# Altium project Holberton.PrjPcb (part 2 of 4)

## Sheet Trinamic.SchDoc
size 420 x 297 mm; SheetNumber: 7; SheetTotal: 14; PageSetup: Record=PageOptions|CenterHorizontal=True|CenterVertical=True|PrintScale=0.96|XCorrection=1.00|YCorrection=1.00|PrintKind=1|BorderSize=5000000|LeftOffset=0|BottomOffset=0|Orientation=2|PaperLength=4318|PaperWidth=2794|Scale=100|PaperSource=7|PrintQuality=600|MediaType=1|DitherType=10|PaperKind=11" x 17"|PrintScaleMode=1
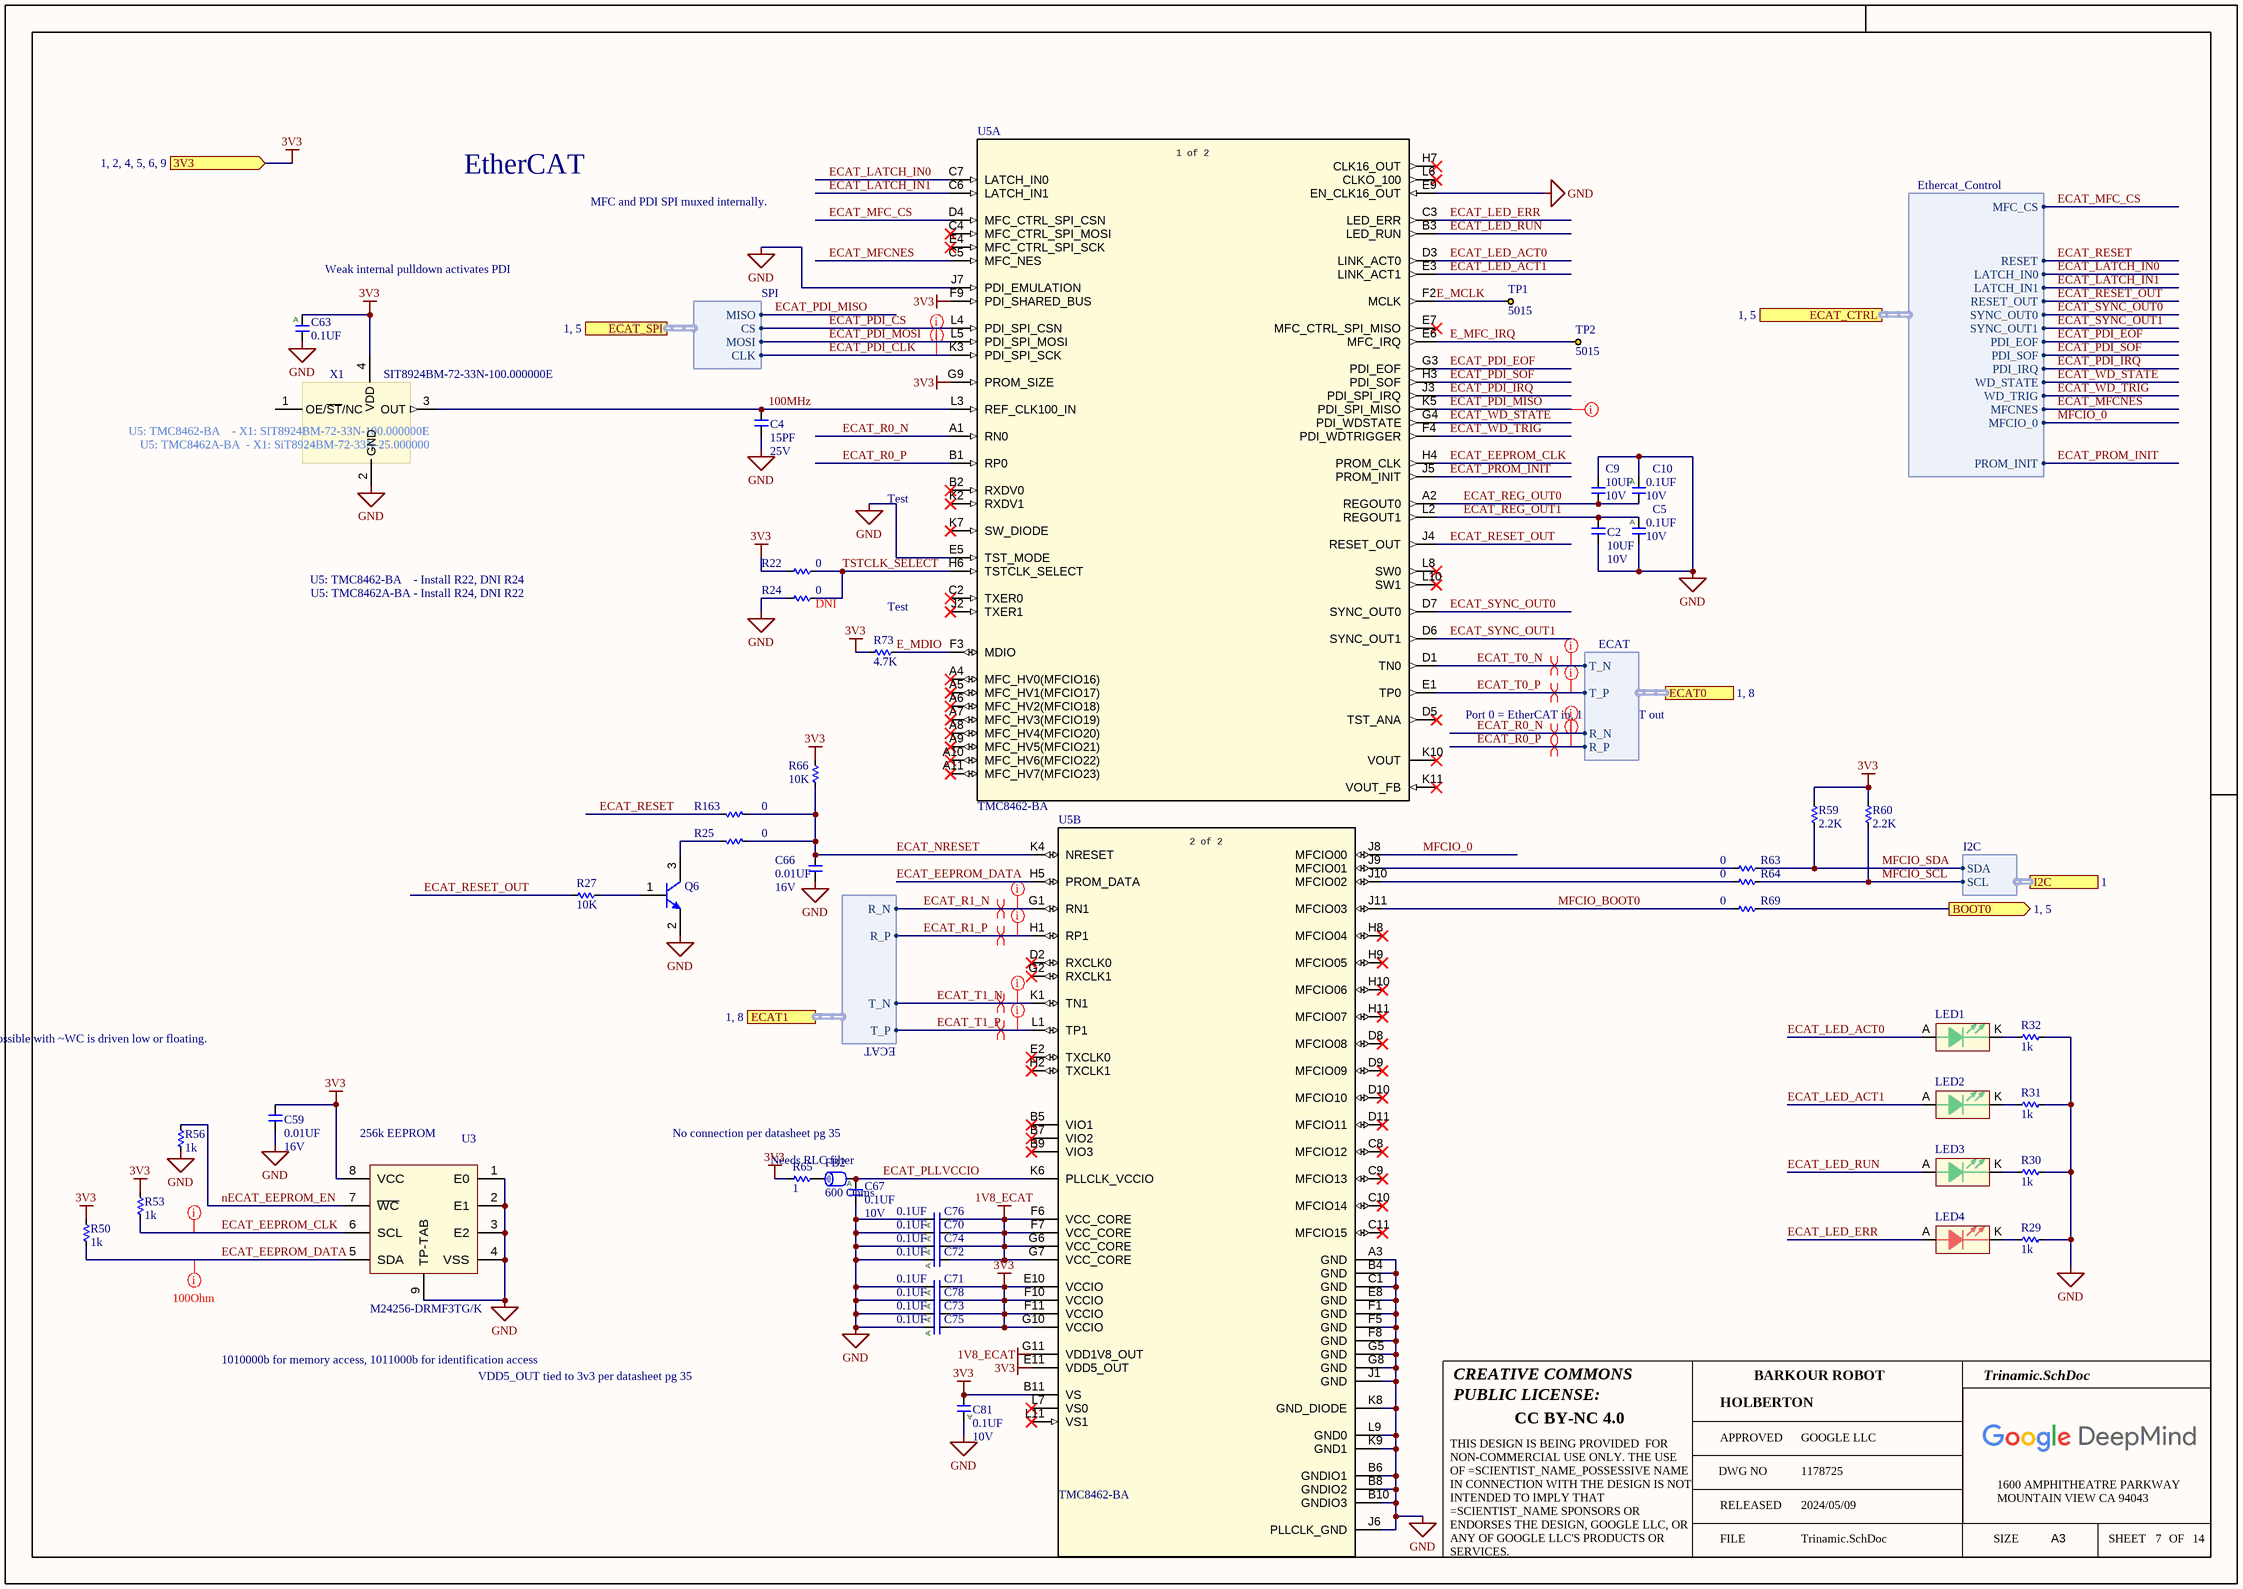
[diagram p4: Trinamic.SchDoc]

### Parts
C2  value 10UF  Voltage: 10V  [C0402]  (hidden comment: __Template_Cap)
C4  value 15PF  Voltage: 25V  [C0201]  (hidden comment: __Template_Cap)
C5  value 0.1UF  Voltage: 10V  [C0201]  (hidden comment: __Template_Cap_Auto)
C9  value 10UF  Voltage: 10V  [C0402]  (hidden comment: __Template_Cap)
C10  value 0.1UF  Voltage: 10V  [C0201]  (hidden comment: __Template_Cap_Auto)
C59  value 0.01UF  Voltage: 16V  [C0201]  (hidden comment: __Template_Cap)
C63  value 0.1UF  [C0201]  (hidden comment: __Template_Cap_Auto)
C66  value 0.01UF  Voltage: 16V  [C0201]  (hidden comment: __Template_Cap)
C67  value 0.1UF  Voltage: 10V  [C0201]  (hidden comment: __Template_Cap_Auto)
C70  value 0.1UF  [C0201]  (hidden comment: __Template_Cap_Auto)
C71  value 0.1UF  [C0201]  (hidden comment: __Template_Cap_Auto)
C72  value 0.1UF  [C0201]  (hidden comment: __Template_Cap_Auto)
C73  value 0.1UF  [C0201]  (hidden comment: __Template_Cap_Auto)
C74  value 0.1UF  [C0201]  (hidden comment: __Template_Cap_Auto)
C75  value 0.1UF  [C0201]  (hidden comment: __Template_Cap_Auto)
C76  value 0.1UF  [C0201]  (hidden comment: __Template_Cap_Auto)
C78  value 0.1UF  [C0201]  (hidden comment: __Template_Cap_Auto)
C81  value 0.1UF  Voltage: 10V  [C0201]  (hidden comment: __Template_Cap_Auto)
FB2  value 600 Ohms  [L0201_H0.33MM]  (hidden comment: __Template_Ferrite_Bead)
LED1  __Template_LED_GREEN_AK  [LED_APHHS1005LCGCK]  (value not drawn)
LED2  __Template_LED_GREEN_AK  [LED_APHHS1005LCGCK]  (value not drawn)
LED3  __Template_LED_GREEN_AK  [LED_APHHS1005LCGCK]  (value not drawn)
LED4  __Template_LED_RED_AK  [LED_APHHS1005LCGCK]  (value not drawn)
Q6  Bipolar NPN 3 Pins Transistor Gummel-Poon Model  [SOT23-3]  (value not drawn)
R22  0  [R0402]
R24  0  [R0402]
R25  0  [R0402]
R27  value 10K  [R0201]  (hidden comment: __Template_Resistor)
R29  value 1k  [R0201]  (hidden comment: __Template_Resistor)
R30  value 1k  [R0201]  (hidden comment: __Template_Resistor)
R31  value 1k  [R0201]  (hidden comment: __Template_Resistor)
R32  value 1k  [R0201]  (hidden comment: __Template_Resistor)
R50  value 1k  [R0201]  (hidden comment: __Template_Resistor)
R53  value 1k  [R0201]  (hidden comment: __Template_Resistor)
R56  value 1k  [R0201]  (hidden comment: __Template_Resistor)
R59  2.2K  [R0201]
R60  2.2K  [R0201]
R63  0  [R0402]
R64  0  [R0402]
R65  1  [R0201]
R66  value 10K  [R0201]  (hidden comment: __Template_Resistor)
R69  0  [R0402]
R73  value 4.7K  [R0201]  (hidden comment: __Template_Resistor)
R163  0  [R0402]
TP1  MFG P/N: 5015  [TP_KEYSTONE_5015]  (hidden comment: TP_KEYSTONE_5015)
TP2  MFG P/N: 5015  [TP_KEYSTONE_5015]  (hidden comment: TP_KEYSTONE_5015)
U3  MFG P/N: M24256-DRMF3TG/K  [8WFDFN300X200X80-8-TP]  (hidden comment: EEPROM_M24256-DRMF3TG/K)
U5  MFG P/N: TMC8462-BA  [BGA121C75P11X11_900X900X145]  (hidden comment: PROCESSOR_TRINAMIC_TMC8462-BA)  (parts A,B of 2)
X1  Mfg P/N: SIT8924BM-72-33N-100.000000E  [XTAL_SIT8924BM-72-33N-100.000000]  (hidden comment: XTAL_SIT8924BM-72-33N-100.000000)

### Ports
3V3 (in, see 1, 2, 4, 5, 6, 9), BOOT0 (out, see 1, 5), ECAT0 (harness ECAT, see 1, 8), ECAT1 (harness ECAT, see 1, 8), ECAT_CTRL (harness Ethercat_Control, see 1, 5), ECAT_SPI (harness SPI, see 1, 5), I2C (harness I2C, see 1)

### Harnesses
Ethercat_Control: MFC_CS, LATCH_IN0, LATCH_IN1, RESET_OUT, SYNC_OUT0, SYNC_OUT1, PDI_EOF, PDI_SOF, PDI_IRQ, RESET, WD_STATE, WD_TRIG, MFCNES, MFCIO_0, PROM_INIT
SPI: MISO, MOSI, CS, CLK
ECAT: R_P, R_N, T_P, T_N
I2C: SDA, SCL

### Nets
1V8_ECAT: C70.2 C72.2 C74.2 C76.2 U5.F6(VCC_CORE) U5.F7(VCC_CORE) U5.G6(VCC_CORE) U5.G7(VCC_CORE) U5.G11(VDD1V8_OUT)
3V3: C59.1 C63.1 C71.2 C73.2 C75.2 C78.2 C81.2 R22.1 R50.2 R53.2 R59.2 R60.2 R65.1 R66.2 R73.2 U3.8(VCC) U5.B11(VS) U5.E10(VCCIO) U5.E11(VDD5_OUT) U5.F9(PDI_SHARED_BUS) U5.F10(VCCIO) U5.F11(VCCIO) U5.G9(PROM_SIZE) U5.G10(VCCIO) X1.4(VDD) ; port 3V3
GND: C2.2 C4.2 C5.2 C9.1 C10.1 C59.2 C63.2 C66.2 C67.2 C70.1 C71.1 C72.1 C73.1 C74.1 C75.1 C76.1 C78.1 C81.1 Q6.2(E) R24.1 R29.1 R30.1 R31.1 R32.1 R56.1 U3.1(E0) U3.2(E1) U3.3(E2) U3.4(VSS) U3.9(TP-TAB) U5.A3(GND) U5.B4(GND) U5.B6(GNDIO1) U5.B8(GNDIO2) U5.B10(GNDIO3) U5.C1(GND) U5.E5(TST_MODE) U5.E8(GND) U5.E9(EN_CLK16_OUT) U5.F1(GND) U5.F5(GND) U5.F8(GND) U5.G5(GND) U5.G8(GND) U5.J1(GND) U5.J6(PLLCLK_GND) U5.J7(PDI_EMULATION) U5.K8(GND_DIODE) U5.K9(GND1) U5.L9(GND0) X1.2(GND)
100MHz: C4.1 U5.L3(REF_CLK100_IN) X1.3(OUT)
BOOT0: R69.2 ; port BOOT0
E_MCLK: TP1.1 U5.F2(MCLK)
E_MDIO: R73.1 U5.F3(MDIO)
E_MFC_IRQ: TP2.1 U5.E6(MFC_IRQ)
ECAT_EEPROM_CLK: R53.1 U3.6(SCL) U5.H4(PROM_CLK)
ECAT_EEPROM_DATA: R50.1 U3.5(SDA) U5.H5(PROM_DATA)
ECAT_LATCH_IN0: U5.C7(LATCH_IN0) ; port ECAT_CTRL.LATCH_IN0
ECAT_LATCH_IN1: U5.C6(LATCH_IN1) ; port ECAT_CTRL.LATCH_IN1
ECAT_LED_ACT0: LED1.A U5.D3(LINK_ACT0)
ECAT_LED_ACT1: LED2.A U5.E3(LINK_ACT1)
ECAT_LED_ERR: LED4.A U5.C3(LED_ERR)
ECAT_LED_RUN: LED3.A U5.B3(LED_RUN)
ECAT_MFC_CS: U5.D4(MFC_CTRL_SPI_CSN) ; port ECAT_CTRL.MFC_CS
ECAT_MFCNES: U5.C5(MFC_NES) ; port ECAT_CTRL.MFCNES
ECAT_NRESET: C66.1 R25.1 R66.1 R163.1 U5.K4(NRESET)
ECAT_PDI_CLK: U5.K3(PDI_SPI_SCK) ; port ECAT_SPI.CLK
ECAT_PDI_CS: U5.L4(PDI_SPI_CSN) ; port ECAT_SPI.CS
ECAT_PDI_EOF: U5.G3(PDI_EOF) ; port ECAT_CTRL.PDI_EOF
ECAT_PDI_IRQ: U5.J3(PDI_SPI_IRQ) ; port ECAT_CTRL.PDI_IRQ
ECAT_PDI_MISO: U5.K5(PDI_SPI_MISO) ; port ECAT_SPI.MISO
ECAT_PDI_MOSI: U5.L5(PDI_SPI_MOSI) ; port ECAT_SPI.MOSI
ECAT_PDI_SOF: U5.H3(PDI_SOF) ; port ECAT_CTRL.PDI_SOF
ECAT_PLLVCCIO: C67.1 FB2.2 U5.K6(PLLCLK_VCCIO)
ECAT_PROM_INIT: U5.J5(PROM_INIT) ; port ECAT_CTRL.PROM_INIT
ECAT_R0_N: U5.A1(RN0) ; port ECAT0.R_N
ECAT_R0_P: U5.B1(RP0) ; port ECAT0.R_P
ECAT_R1_N: U5.G1(RN1) ; port ECAT1.R_N
ECAT_R1_P: U5.H1(RP1) ; port ECAT1.R_P
ECAT_REG_OUT0: C9.2 C10.2 U5.A2(REGOUT0)
ECAT_REG_OUT1: C2.1 C5.1 U5.L2(REGOUT1)
ECAT_RESET: R163.2 ; port ECAT_CTRL.RESET
ECAT_RESET_OUT: R27.2 U5.J4(RESET_OUT) ; port ECAT_CTRL.RESET_OUT
ECAT_SYNC_OUT0: U5.D7(SYNC_OUT0) ; port ECAT_CTRL.SYNC_OUT0
ECAT_SYNC_OUT1: U5.D6(SYNC_OUT1) ; port ECAT_CTRL.SYNC_OUT1
ECAT_T0_N: U5.D1(TN0) ; port ECAT0.T_N
ECAT_T0_P: U5.E1(TP0) ; port ECAT0.T_P
ECAT_T1_N: U5.K1(TN1) ; port ECAT1.T_N
ECAT_T1_P: U5.L1(TP1) ; port ECAT1.T_P
ECAT_WD_STATE: U5.G4(PDI_WDSTATE) ; port ECAT_CTRL.WD_STATE
ECAT_WD_TRIG: U5.F4(PDI_WDTRIGGER) ; port ECAT_CTRL.WD_TRIG
MFCIO_0: U5.J8(MFCIO00) ; port ECAT_CTRL.MFCIO_0  [project net ECAT_MFCIO_0]
MFCIO_BOOT0: R69.1 U5.J11(MFCIO03)
MFCIO_SCL: R60.1 R64.2 ; port I2C.SCL
MFCIO_SDA: R59.1 R63.2 ; port I2C.SDA
nECAT_EEPROM_EN: R56.2 U3.7(~{WC})
TSTCLK_SELECT: R22.2 R24.2 U5.H6(TSTCLK_SELECT)
NetFB2_1: FB2.1 R65.2
NetLED1_K: LED1.K R32.2
NetLED2_K: LED2.K R31.2
NetLED3_K: LED3.K R30.2
NetLED4_K: LED4.K R29.2
NetQ6_1: Q6.1(B) R27.1
NetQ6_3: Q6.3(C) R25.2
NetR63_1: R63.1 U5.J9(MFCIO01)
NetR64_1: R64.1 U5.J10(MFCIO02)

Not connected (* = marked no-connect by the designer): U5 A4(MFC_HV0(MFCIO16))* A5(MFC_HV1(MFCIO17))* A6(MFC_HV2(MFCIO18))* A7(MFC_HV3(MFCIO19))* A8(MFC_HV4(MFCIO20))* A9(MFC_HV5(MFCIO21))* A10(MFC_HV6(MFCIO22))* A11(MFC_HV7(MFCIO23))* B2(RXDV0)* B5(VIO1)* B7(VIO2)* B9(VIO3)* C2(TXER0)* C4(MFC_CTRL_SPI_MOSI)* C8(MFCIO12)* C9(MFCIO13)* C10(MFCIO14)* C11(MFCIO15)* D2(RXCLK0)* D5(TST_ANA)* D8(MFCIO08)* D9(MFCIO09)* D10(MFCIO10)* D11(MFCIO11)* E2(TXCLK0)* E4(MFC_CTRL_SPI_SCK)* E7(MFC_CTRL_SPI_MISO)* G2(RXCLK1)* H2(TXCLK1)* H7(CLK16_OUT)* H8(MFCIO04)* H9(MFCIO05)* H10(MFCIO06)* H11(MFCIO07)* J2(TXER1)* K2(RXDV1)* K7(SW_DIODE)* K10(VOUT)* K11(VOUT_FB)* L6(CLKO_100)* L7(VS0)* L8(SW0)* L10(SW1)* L11(VS1)*; X1 1(OE/~{ST}/NC)

### Layout directives
net class SE50Ohm: ECAT_PDI_CLK, ECAT_PDI_MISO, ECAT_PDI_MOSI
net class Diff100Ohm: ECAT_R0_N, ECAT_R0_P, ECAT_R1_N, ECAT_R1_P, ECAT_T0_N, ECAT_T0_P, ECAT_T1_N, ECAT_T1_P
differential pair; differential pair class 100Ohm: ECAT_R0_N, ECAT_R0_P, ECAT_R1_N, ECAT_R1_P, ECAT_T0_N, ECAT_T0_P, ECAT_T1_N, ECAT_T1_P
net class SE100Ohm: ECAT_EEPROM_CLK, ECAT_EEPROM_DATA

### Notes on the sheet
- EtherCAT
- (near U5) MFC and PDI SPI muxed internally.
- Weak internal pulldown activates PDI
- U5: TMC8462-BA    - X1: SIT8924BM-72-33N-100.000000E
- (near X1) U5: TMC8462A-BA  - X1: SiT8924BM-72-33N-25.000000
- (near U5) Test
- U5: TMC8462-BA    - Install R22, DNI R24
- U5: TMC8462A-BA - Install R24, DNI R22
- Test
- Port 0 = EtherCAT in, 1 = EtherCAT out
- Writes are possible with ~WC is driven low or floating.
- (near U3) 256k EEPROM
- (near U5) No connection per datasheet pg 35
- Needs RLC filter
- 1010000b for memory access, 1011000b for identification access
- VDD5_OUT tied to 3v3 per datasheet pg 35
- CREATIVE COMMONS
- PUBLIC LICENSE:
- BARKOUR ROBOT
- CC BY-NC 4.0
- APPROVED
- DWG NO
- GOOGLE LLC
- FILE
- RELEASED
- 2024/05/09
- SIZE
- 1600 AMPHITHEATRE PARKWAY
- MOUNTAIN VIEW CA 94043
- A3
- SHEET
- OF
- THIS DESIGN IS BEING PROVIDED  FOR NON-COMMERCIAL USE ONLY. THE USE OF =SCIENTIST_NAME_POSSESSIVE NAME IN CONNECTION WITH THE DESIGN IS NOT INTENDED TO IMPLY THAT =SCIENTIST_NAME SPONSORS OR ENDORSES THE DESIGN, GOOGLE LLC, OR ANY OF GOOGLE LLC'S PRODUCTS OR SERVICES.
- (in symbol 113, part A) 1 of 2
- (in symbol 113, part B) 2 of 2
- (in symbol 934) A

### Library data of the parts
C2 C9 = 215: CAP, CER, X5R, 10uF, 10V, 20%, 0402, 0.7mm T; MFG: SAMSUNG; MFG P/N: CL05A106MP5NUNC; COMMON: 150-00376-00; Status: Released; Package: 0402; Supplier 1: Digi-Key; ComponentLink1URL: https://www.digikey.com/en/products/detail/samsung-electro-mechanics/CL05A106MP5NUNC/3887108; Supplier Part Number 1: 1276-1450-1-ND
C4 = 1033: CAP, CER, NP0, 15pF, 25V, 5%, 0201, 0.9mm T; MFG: TDK; MFG P/N: C0603C0G1E150J030BA; COMMON: 150-00968-00; Status: NRND; Package: 0201; Supplier 1: Digi-Key; ComponentLink1URL: https://www.digikey.com/en/products/detail/tdk-corporation/C0603C0G1E150J030BA/2050004; Supplier Part Number 1: 445-4655-1-ND
C5 C10 C63 C67 C70-C76 C78 C81 = 934: as C51 on sheet Processor; Status: Released; Package: 0201; Supplier 1: Digi-key; ComponentLink1URL: https://search.murata.co.jp/Ceramy/image/img/A01X/G101/ENG/GRT033C81A104KE01-01.pdf; Supplier Part Number 1: 490-12232-1-ND
  C63 C70-C76 C78: Voltage: 10V
C59 C66 = 361: CAP, CER, X5R, 0.01uF, 16V, 10%, 0201, 0.33mm T; MFG: MURATA; MFG P/N: GRM033R61C103KA12D; COMMON: 150-00126-00; Status: Released; Package: 0201; Supplier 1: Digi-Key; ComponentLink1URL: https://www.digikey.com/en/products/detail/murata-electronics/GRM033R61C103KA12D/4213197; Supplier Part Number 1: 490-7223-1-ND
FB2 = 867: FERRITE, BEAD, 600OHMS @100MHZ, 25%, 250mA, 900 mOHM DCR, 0201; MFG: Murata Electronics North America; MFG P/N: BLM03AX601SN1D; Status: Released; Package: 0201 (0603 Metric); Supplier 1: Digi-Key; ComponentLink1URL: https://www.murata.com/en-us/products/productdata/8796741140510/ENFA0020.pdf; Supplier Part Number 1: 490-5624-1-ND
LED1-LED3 = 306: LED, GREEN, 574nm, 2mA, CLEAR, 0402; MFG: Kingbright; MFG P/N: APHHS1005LCGCK; Value: APHHS1005LCGCK; Status: Released; Package: 0402; Supplier 1: Digi-Key; ComponentLink1URL: http://www.kingbrightusa.com/images/catalog/SPEC/APHHS1005LCGCK.pdf; Supplier Part Number 1: 754-2121-1-ND
LED4 = 309: LED, RED, 640NM, 2mA, CLEAR, 0402; MFG: Kingbright; MFG P/N: APHHS1005LSECK/J3-PF; Value: APHHS1005LSECK/J3-PF; Status: Released; Package: 0402; Supplier 1: Digi-Key; ComponentLink1URL: http://www.kingbrightusa.com/images/catalog/SPEC/APHHS1005LSECK-J3-PF.pdf; Supplier Part Number 1: 754-2123-1-ND
Q6 = BJT NPN_GP: TRANS NPN 40V 0.2A SOT23-3; MFG: NTE Electronics, Inc; MFG P/N: MMBT3904; Value: MMBT3904; ComponentLink1URL: https://www.digikey.com/en/products/detail/nte-electronics-inc/MMBT3904/11649623; Package: SOT23-3; Status: Preliminary; Supplier 1: Digi-Key; Supplier Part Number 1: 2368-MMBT3904-ND
R22 R24 R25 R63 R64 R69 R163 = 8004: RES, 0, JUMPER, 1/16W, 0402; MFG: YAGEO; MFG P/N: RC0402FR-070RL; COMMON: 470-02332-00; Status: Released; Package: 0402; Value: 0; Supplier 1: Digi-Key; ComponentLink1URL: https://www.digikey.com/en/products/detail/yageo/RC0402FR-070RL/2827570; Supplier Part Number 1: 311-0.0LRCT-ND
  R24: DNI: DNI
R27 R66 = 6783: as R5 on sheet Processor; Status: Released; Package: 0201; Supplier 1: Digi-Key; ComponentLink1URL: https://industrial.panasonic.com/cdbs/www-data/pdf/RDA0000/AOA0000C304.pdf; Supplier Part Number 1: P122414CT-ND
R29-R32 R50 R53 R56 = 10010: RES, 1K, 1%, 1/20W, 0201, AUTOGRADE; MFG: Bourns Inc.; MFG P/N: CR0201AFW-1001GLF; Status: Released; Package: 0201; Supplier 1: Digi-Key; ComponentLink1URL: https://www.bourns.com/docs/product-datasheets/crxxxxa.pdf; Supplier Part Number 1: 118-CR0201AFW-1001GLFCT-ND
R59 R60 = 3569: Resistor, 2.20K Ohms, 0201, 0.05W, ±1%; MFG: PANASONIC; MFG P/N: ERJ-1GNF2201C; Status: Released; Package: 0201; Value: 2.2K; Supplier 1: Digi-Key; ComponentLink1URL: https://www.digikey.com/en/products/detail/panasonic-electronic-components/ERJ-1GNF2201C/8342603; Supplier Part Number 1: P122832CT-ND
R65 = 7413: RES, 1.0, 5%, 1/20W, 0201; MFG: PANASONIC; MFG P/N: ERJ-1GNJ1R0C; Status: released; Package: 0201; Value: 1; Supplier 1: Digi-Key; ComponentLink1URL: https://www.digikey.com/en/products/detail/panasonic-electronic-components/ERJ-1GNJ1R0C/2035715; Supplier Part Number 1: P123262CT-ND
R73 = 10025: RES, 4.7K, 1%, 1/20W, 0201, AUTOGRADE; MFG: Panasonic Electronic Components; MFG P/N: ERJ-1GNF4701C; Status: Released; Package: 0201; Supplier 1: Digi-Key; ComponentLink1URL: https://industrial.panasonic.com/cdbs/www-data/pdf/RDA0000/AOA0000C304.pdf; Supplier Part Number 1: P123031CT-ND
TP1 TP2 = 176: PC TEST POINT MINIATURE SMT; MFG: Keystone Electronics; COMMON: 250-00207-00; Value: 5015; Status: In Development; Supplier 1: Digi-Key; ComponentLink1URL: http://mail.keyelco.com/ENG._DEPT/PDF%20CAT%20NO%20Drawings/5015.pdf; Supplier Part Number 1: 36-5015CT-ND
U3 = 423: IC, MEMORY, M24256, EEPROM, 256Kb, I2C, 1MHz, MLP-8, AUTOGRADE; MFG: STMicroelectronics; Status: Released; Package: 8-WFDFN; Supplier 1: Digi-Key; ComponentLink1URL: https://www.st.com/content/ccc/resource/technical/document/datasheet/a7/9b/dd/87/57/59/41/8c/DM00061669.pdf/files/DM00061669.pdf/jcr:content/translations/en.DM00061669.pdf; Supplier Part Number 1: 497-15355-6-ND; Value: M24256-DRMF3TG/K
U5 = 113: IC, CONTROLLER, TMC8462, ETHERNET, 100Mb, SPI, PWM O/P, 100mA, BGA-121; MFG: Trinamic Motion Control GmbH; Status: Released; Package: 121-BGA (9x9); Supplier 1: Digi-Key; ComponentLink1URL: https://www.trinamic.com/products/integrated-circuits/details/tmc8462-ba/; Supplier Part Number 1: 1460-1258-ND; Value: TMC8462-BA
X1 = 137: OSC, MEMS, XO, 100MHZ, +/-25PPM STAB, LVCMOS, 3.3V, SMD-4, AUTOGRADE; Mfg: SiTIME; Status: Released; Package: 4-SMD, No Lead; Supplier 1: Digi-Key; ComponentLink1URL: https://source.z2data.com/2019/9/26/1/9/50/497/69995916/SiT8924.pdf; Supplier Part Number 1: 1473-SIT8924BM-72-33N-100.000000E-ND; Value: 100MHZ

## Sheet Power.SchDoc
size 420 x 297 mm; SheetNumber: 4; SheetTotal: 14; PageSetup: Record=PageOptions|CenterHorizontal=True|CenterVertical=True|PrintScale=0.96|XCorrection=1.00|YCorrection=1.00|PrintKind=1|BorderSize=5000000|LeftOffset=0|BottomOffset=0|Orientation=2|PaperLength=4318|PaperWidth=2794|Scale=100|PaperSource=7|PrintQuality=600|MediaType=1|DitherType=10|PaperKind=11" x 17"|PrintScaleMode=1
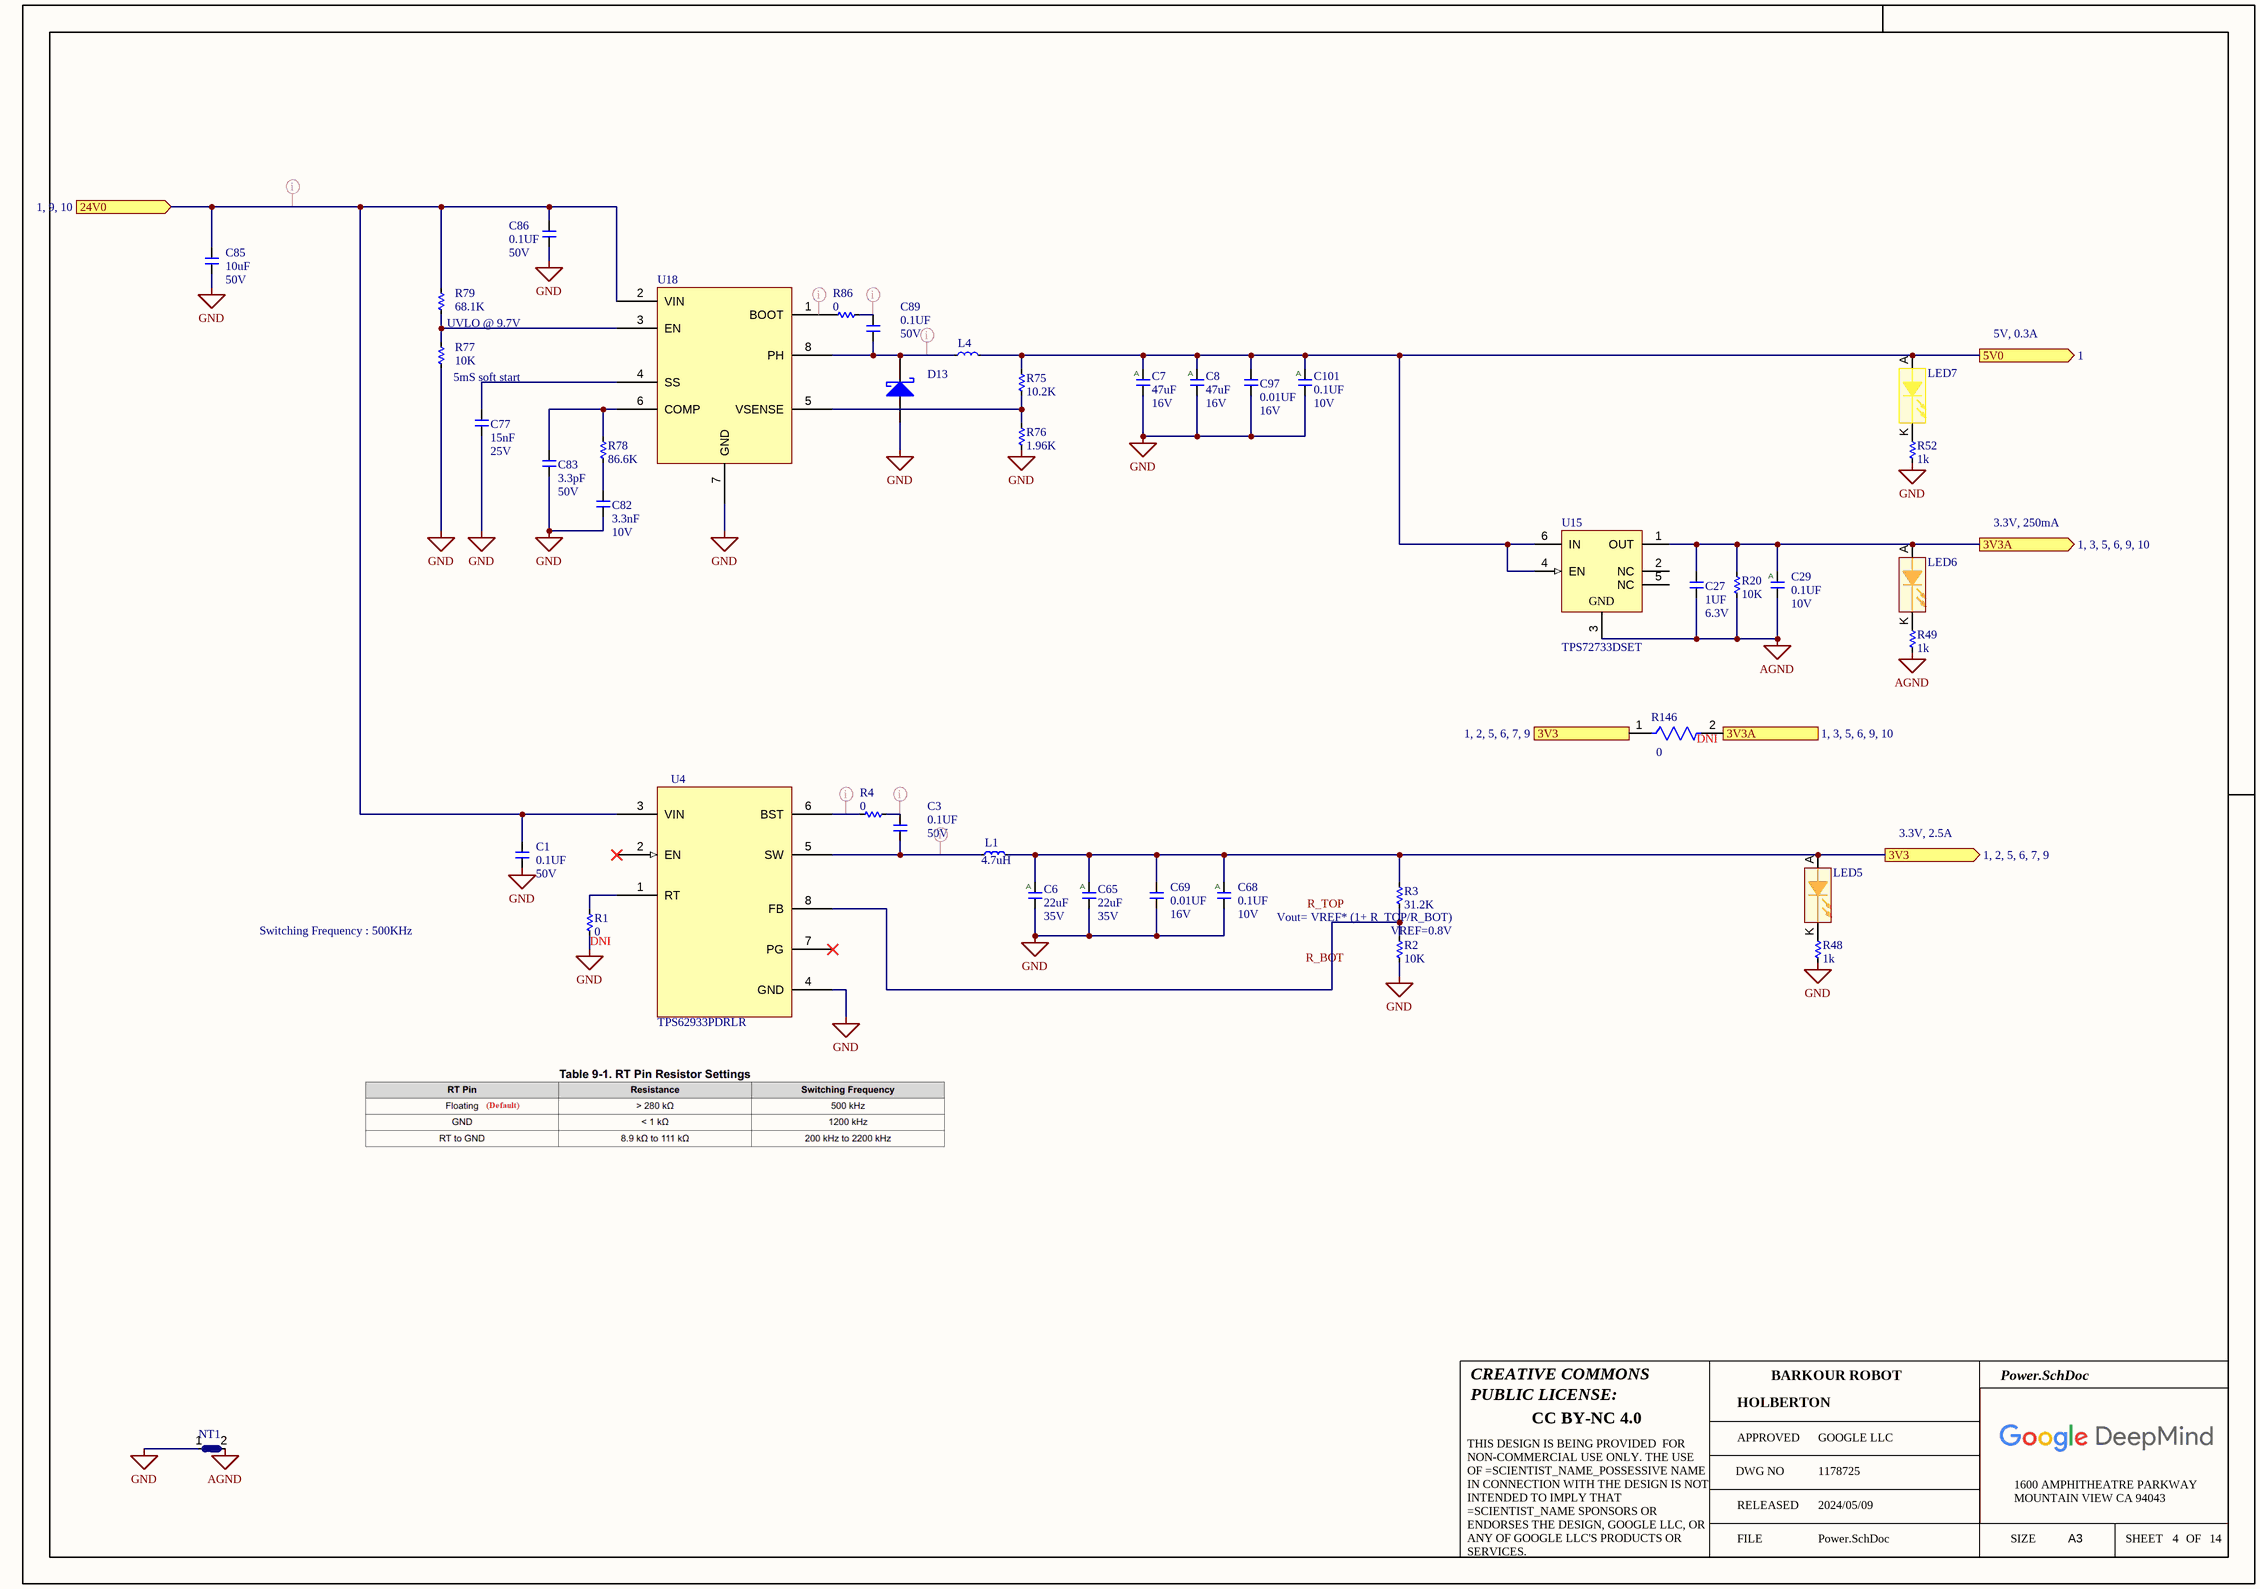
[diagram p5: Power.SchDoc]

### Parts
C1  value 0.1UF  Voltage: 50V  [C0402]  (hidden comment: __Template_Cap)
C3  value 0.1UF  Voltage: 50V  [C0402]  (hidden comment: __Template_Cap)
C6  Voltage: 35V  [C1206]  (hidden comment: 22uF)
C7  value 47uF  Voltage: 16V  [C2220]  (hidden comment: __Template_Cap_Auto)
C8  value 47uF  Voltage: 16V  [C2220]  (hidden comment: __Template_Cap_Auto)
C27  value 1UF  Voltage: 6.3V  [C0201]  (hidden comment: __Template_Cap)
C29  value 0.1UF  Voltage: 10V  [C0201]  (hidden comment: __Template_Cap_Auto)
C65  Voltage: 35V  [C1206]  (hidden comment: 22uF)
C68  value 0.1UF  Voltage: 10V  [C0201]  (hidden comment: __Template_Cap_Auto)
C69  value 0.01UF  Voltage: 16V  [C0201]  (hidden comment: __Template_Cap)
C77  value 15nF  Voltage: 25V  [C0402]  (hidden comment: __Template_Cap)
C82  value 3.3nF  Voltage: 10V  [C0201]  (hidden comment: __Template_Cap)
C83  value 3.3pF  Voltage: 50V  [C0201]  (hidden comment: __Template_Cap)
C85  value 10uF  Voltage: 50V  [C1210]  (hidden comment: __Template_Cap)
C86  value 0.1UF  Voltage: 50V  [C0402]  (hidden comment: __Template_Cap)
C89  value 0.1UF  Voltage: 50V  [C0402]  (hidden comment: __Template_Cap)
C97  value 0.01UF  Voltage: 16V  [C0201]  (hidden comment: __Template_Cap)
C101  value 0.1UF  Voltage: 10V  [C0201]  (hidden comment: __Template_Cap_Auto)
D13  __Template_DIODE_SCHOTTKY  [SOD-123_H1.35MM]  (value not drawn)
L1  4.7uH  [IND_78438357047]
L4  COILCRAFT_LPS3015-473  [COILCRAFT_LPS3015-473]  (value not drawn)
LED5  __Template_LED_ORANGE_AK  [LED_APG0603SYC-TT]  (value not drawn)
LED6  __Template_LED_ORANGE_AK  [LED_APG0603SYC-TT]  (value not drawn)
LED7  __Template_LED_YELLOW_AK  [LED_APG0603SYC-TT]  (value not drawn)
NT1  _Template_NETTIE  [NETTIE_0402]  (value not drawn)  (net tie, no BOM)
R1  0  [R0402]
R2  10K  [R0402]
R3  31.2K  [R0402]
R4  0  [R0402]
R20  value 10K  [R0201]  (hidden comment: __Template_Resistor)
R48  value 1k  [R0201]  (hidden comment: __Template_Resistor)
R49  value 1k  [R0201]  (hidden comment: __Template_Resistor)
R52  value 1k  [R0201]  (hidden comment: __Template_Resistor)
R75  10.2K  [R0201]
R76  1.96K  [R0201]
R77  value 10K  [R0201]  (hidden comment: __Template_Resistor)
R78  86.6K  [R0201]
R79  68.1K  [R0402]
R86  0  [R0402]
R146  0  [R0402]
U4  TPS62933PDRLR  [SOT-583]
U15  TPS72733DSET  [6WSON]
U18  TI_TPS54331GDR  [SOIC127P600X175-8N]  (value not drawn)

### Ports
3V3 (out, see 1, 2, 5, 6, 7, 9), 3V3A (out, see 1, 3, 5, 6, 9, 10), 5V0 (out, see 1), 24V0 (in, see 1, 9, 10)

### Nets
3V3: C6.1 C65.1 C68.1 C69.1 L1.2 LED5.A R3.2 R146.1 ; port 3V3
3V3A: C27.1 C29.1 LED6.A R20.2 R146.2 U15.1(OUT) ; port 3V3A
AGND: C27.2 C29.2 NT1.2 R20.1 R49.2 U15.3(GND)
GND: C1.2 C6.2 C7.2 C8.2 C65.2 C68.2 C69.2 C77.2 C82.2 C83.2 C85.2 C86.2 C97.2 C101.2 D13.A NT1.1 R1.1 R2.1 R48.2 R52.2 R76.1 R77.1 U4.4(GND) U18.7(GND)
24V0: C1.1 C85.1 C86.1 R79.2 U4.3(VIN) U18.2(VIN) ; port 24V0
NetC3_1: C3.1 R4.2
NetC3_2: C3.2 L1.1 U4.5(SW)
NetC7_1: C7.1 C8.1 C97.1 C101.1 L4.2 LED7.A R75.2 U15.4(EN) U15.6(IN) ; port 5V0
NetC77_1: C77.1 U18.4(SS)
NetC82_1: C82.1 R78.1
NetC83_1: C83.1 R78.2 U18.6(COMP)
NetC89_1: C89.1 R86.2
NetC89_2: C89.2 D13.K L4.1 U18.8(PH)
NetLED5_K: LED5.K R48.1
NetLED6_K: LED6.K R49.1
NetLED7_K: LED7.K R52.1
NetR1_2: R1.2 U4.1(RT)
NetR2_2: R2.2 R3.1 U4.8(FB)
NetR4_1: R4.1 U4.6(BST)
NetR75_1: R75.1 R76.2 U18.5(VSENSE)
NetR77_2: R77.2 R79.1 U18.3(EN)
NetR86_1: R86.1 U18.1(BOOT)

Not connected (* = marked no-connect by the designer): U4 2(EN)* 7(PG)*; U15 2(NC) 5(NC)

### Layout directives
net class 24V: 24V0, (no net found under the mark), NetC3_1, NetC3_2, NetC89_1, NetC89_2, NetR4_1

### Notes on the sheet
- UVLO @ 9.7V
- 5mS soft start
- 5V, 0.3A
- 3.3V, 250mA
- 3.3V, 2.5A
- (near R1) Switching Frequency : 500KHz
- (near R3) R_TOP
- Vout= VREF* (1+ R_TOP/R_BOT)
- VREF=0.8V
- (near R2) R_BOT
- CREATIVE COMMONS
- PUBLIC LICENSE:
- BARKOUR ROBOT
- CC BY-NC 4.0
- APPROVED
- DWG NO
- GOOGLE LLC
- FILE
- RELEASED
- 2024/05/09
- SIZE
- 1600 AMPHITHEATRE PARKWAY
- MOUNTAIN VIEW CA 94043
- A3
- SHEET
- OF
- THIS DESIGN IS BEING PROVIDED  FOR NON-COMMERCIAL USE ONLY. THE USE OF =SCIENTIST_NAME_POSSESSIVE NAME IN CONNECTION WITH THE DESIGN IS NOT INTENDED TO IMPLY THAT =SCIENTIST_NAME SPONSORS OR ENDORSES THE DESIGN, GOOGLE LLC, OR ANY OF GOOGLE LLC'S PRODUCTS OR SERVICES.
- (in symbol 163) A
- (in symbol 934) A

### Library data of the parts
C1 C3 C86 C89 = 1762: CAP, CER, X5R, 0.1uF, 10%, 50V, 0402, 0.55mm; MFG: YAGEO; MFG P/N: CC0402KRX5R9BB104; Status: Released; Package: 0402; Supplier 1: Digi-Key; ComponentLink1URL: http://www.yageo.com/documents/recent/UPY-GPHC_X5R_4V-to-50V_25.pdf; Supplier Part Number 1: 311-3342-1-ND
C6 C65 = 163: CAP CER 22UF 35V X5R 1206; MFG: TDK Corporation; MFG P/N: C3216X5R1V226M160AC; Status: Released; Package: 1206; Value: 22uF; Supplier 1: Digi-Key; ComponentLink1URL: https://www.digikey.com/en/products/detail/tdk-corporation/C3216X5R1V226M160AC/2792261?s=N4IgTCBcDaIMIGYwEYBsANArAJWQNTDFQFk0AGAQThAF0BfIA; Supplier Part Number 1: 445-8045-1-ND
C7 C8 = 163: CAP, CER, X7R, 47uF, 16V, 20%, AUTO GRADE, 2220, 2.5mm T; MFG: TDK; MFG P/N: CGA9N3X7R1C476M230KB; COMMON: 150-00499-00; Status: Released; Package: 2220; Supplier 1: Digi-Key; ComponentLink1URL: https://www.digikey.com/en/products/detail/tdk-corporation/CGA9N3X7R1C476M230KB/2781361; Supplier Part Number 1: 445-7935-1-ND
C27 = 240: as C118 on sheet ProcessorSupport; Status: Released; Package: 0201; Supplier 1: Digi-Key; ComponentLink1URL: https://www.digikey.com/en/products/detail/samsung-electro-mechanics/CL03A105MQ3CSNC/3886983; Supplier Part Number 1: 1276-1325-1-ND
C29 C68 C101 = 934: as C51 on sheet Processor; Status: Released; Package: 0201; Supplier 1: Digi-key; ComponentLink1URL: https://search.murata.co.jp/Ceramy/image/img/A01X/G101/ENG/GRT033C81A104KE01-01.pdf; Supplier Part Number 1: 490-12232-1-ND
C69 C97 = 361: as C59 on sheet Trinamic; Status: Released; Package: 0201; Supplier 1: Digi-Key; ComponentLink1URL: https://www.digikey.com/en/products/detail/murata-electronics/GRM033R61C103KA12D/4213197; Supplier Part Number 1: 490-7223-1-ND
C77 = 838: CAP, CER, X7R, 0.015uF, 25V, 10%, 0402, 0.56mm T; MFG: MURATA; MFG P/N: GRM155R71E153KA61D; COMMON: 150-00741-00; Status: NRND; Package: 0402; Supplier 1: Digi-Key; ComponentLink1URL: https://www.digikey.com/en/products/detail/murata-electronics/GRM155R71E153KA61D/702516; Supplier Part Number 1: 490-3251-1-ND
C82 = 343: CAP, CER, X5R, 3300pF, 10V, 10%, 0201, 0.33mm T; MFG: AVX; MFG P/N: 0201ZD332KAT2A; COMMON: 150-00555-00; Status: Released; Package: 0201; Supplier 1: Digi-Key; ComponentLink1URL: https://www.digikey.com/en/products/detail/kyocera-avx/0201ZD332KAT2A/563155; Supplier Part Number 1: 478-1045-1-ND
C83 = 589: CAP, CER, NP0, 3.3pF, 50V, +/-0.25pF, 0201, 0.33mm T; MFG: MURATA; MFG P/N: GRM0335C1H3R3CA01D; COMMON: 150-00958-00; Status: Released; Package: 0201; Supplier 1: Digi-Key; ComponentLink1URL: https://www.digikey.com/en/products/detail/murata-electronics/GRM0335C1H3R3CA01D/2542225; Supplier Part Number 1: 490-6128-1-ND
C85 = 1813: CAP, CER, X5R, 10uF, 50V, 20%, 1210; MFG: TAIYO YUDEN; MFG P/N: UMK325BJ106MM-T; Status: Released; Package: 1210; Supplier 1: Digi-Key; ComponentLink1URL: https://media.digikey.com/pdf/Data%20Sheets/Taiyo%20Yuden%20PDFs%20URL%20links/UMK325BJ106MM-T_Spec.pdf; Supplier Part Number 1: 587-2225-1-ND
D13 = 290: DIODE, SCHOTTKY, 30V VRRM, 1A IO, 12A SURGE, SOD-123; MFG: Diodes Incorporated; MFG P/N: B130LAW-7-F; Value: B130LAW-7-F; Status: Released; Package: SOD-123; Supplier 1: Digi-Key; ComponentLink1URL: https://www.diodes.com/assets/Datasheets/ds30308.pdf; Supplier Part Number 1: B130LAW-FDICT-ND
L1 = BOURNS_SRR1050A-180Y: FIXED IND 4.7UH 3.9A 44MOHM SMD; MFG: Würth Elektronik; MFG P/N: 78438357047; Supplier 1: Digi-Key; Supplier Part Number 1: 732-11742-1-ND; ComponentLink1URL: https://www.bourns.com/docs/Product-Datasheets/SRR1050A.pdf?src-supplier=Digi-Key; Value: 4.7uH
L4 = COILCRAFT_LPS3015-473: COILCRAFT   LPS3015-473MRB   INDUCTOR, SHLD, 47UH, 20%, 0.3A, SMD; MFG P/N: XFL3012-473MEC; Supplier 1: Mouser; Supplier Part Number 1: 994-XFL3012-473MEC; ComponentLink1URL: https://www.mouser.com/ProductDetail/Coilcraft/XFL3012-473MEC?qs=zCSbvcPd3pb%2FTL0aawZbwA%3D%3D; MFG: Coilcraft; Value: 47uH
LED5 LED6 = 308: LED, ORANGE, 611NM, 10mA, CLEAR, 0201; MFG: Kingbright; MFG P/N: APG0603SEC-TT; Value: APG0603SEC-TT; Status: Released; Package: 0201; Supplier 1: Digi-Key; ComponentLink1URL: http://www.kingbrightusa.com/images/catalog/SPEC/APG0603SEC-TT.pdf; Supplier Part Number 1: 754-2027-1-ND
LED7 = 307: LED, YELLOW, 591NM, 10mA, CLEAR, 0201; MFG: Kingbright; MFG P/N: APG0603SYC-TT; Value: APG0603SYC-TT; Status: Released; Package: 0201; Supplier 1: Digi-Key; ComponentLink1URL: http://www.kingbrightusa.com/images/catalog/SPEC/APG0603SYC-TT.pdf; Supplier Part Number 1: 754-2025-1-ND
NT1 = 158: Net Ties, 0402; MFG: _PCB Feature; Status: Released
R1 R4 R86 = 8004: as R22 on sheet Trinamic; Status: Released; Package: 0402; Value: 0; Supplier 1: Digi-Key; ComponentLink1URL: https://www.digikey.com/en/products/detail/yageo/RC0402FR-070RL/2827570; Supplier Part Number 1: 311-0.0LRCT-ND
  R1: DNI: DNI
R2 = 7216: RES, 10K, 1%, 1/10W, 0402, AUTOGRADE; MFG: PANASONIC; MFG P/N: ERJ2RKF1002X; COMMON: 470-00319-00; Status: Released; Package: 0402; Value: 10K; Supplier 1: Digi-Key; ComponentLink1URL: https://www.digikey.com/en/products/detail/panasonic-electronic-components/ERJ-2RKF1002X/192073; Supplier Part Number 1: P10.0KLCT-ND
R3 = 4161: RES 31.2K OHM 1% 1/16W 0402; MFG: KOA Speer Electronics, Inc.; MFG P/N: RN73H1ETTP3122F25; Status: Released; Package: 0402; Value: 31.2K; Supplier 1: Digi-Key; ComponentLink1URL: https://www.digikey.com/en/products/detail/yageo/RC0201FR-0710K2L/1948867; Supplier Part Number 1: 2019-RN73H1ETTP3122F25CT-ND
R20 R77 = 6783: as R5 on sheet Processor; Status: Released; Package: 0201; Supplier 1: Digi-Key; ComponentLink1URL: https://industrial.panasonic.com/cdbs/www-data/pdf/RDA0000/AOA0000C304.pdf; Supplier Part Number 1: P122414CT-ND
R48 R49 R52 = 10010: as R29 on sheet Trinamic; Status: Released; Package: 0201; Supplier 1: Digi-Key; ComponentLink1URL: https://www.bourns.com/docs/product-datasheets/crxxxxa.pdf; Supplier Part Number 1: 118-CR0201AFW-1001GLFCT-ND
R75 = 4161: Resistor, 10.2K Ohms, 0201, 0.05W, ±1%; MFG: YAGEO; MFG P/N: RC0201FR-0710K2L; COMMON: 470-07513-00; Status: Released; Package: 0201; Value: 10.2K; Supplier 1: Digi-Key; ComponentLink1URL: https://www.digikey.com/en/products/detail/yageo/RC0201FR-0710K2L/1948867; Supplier Part Number 1: 311-10.2KMCT-ND
R76 = 6790: RES, 1.96K, 1%, 1/20W, 0201; MFG: PANASONIC; MFG P/N: ERJ1GEF1961C; COMMON: 470-00892-00; Status: NRND; Package: 0201; Value: 1.96K; Supplier 1: Digi-Key; ComponentLink1URL: https://www.digikey.com/en/products/detail/panasonic-electronic-components/ERJ-1GEF1961C/1467048; Supplier Part Number 1: P1.96KABCT-ND
R78 = 4926: Resistor, 86.6K Ohms, 0201, 0.05W, ±1%; MFG: PANASONIC; MFG P/N: ERJ-1GNF8662C; Status: Released; Package: 0201; Value: 86.6K; Supplier 1: Digi-Key; ComponentLink1URL: https://www.digikey.com/en/products/detail/panasonic-electronic-components/ERJ-1GNF8662C/8343311; Supplier Part Number 1: P123186CT-ND
R79 = 10007: RES, 68.1K, 1%, 1/16W, 0402; MFG: Stackpole Electronics Inc; MFG P/N: RMCF0402FT68K1; Status: Released; Package: 0402; Value: 68.1K; Supplier 1: Digi-Key; ComponentLink1URL: https://www.digikey.com/en/products/detail/stackpole-electronics-inc/RMCF0402FT68K1/1761637; Supplier Part Number 1: RMCF0402FT68K1CT-ND
R146 = CMP-2002-08122-2: RES, 0, JUMPER, 1/16W, 0402; MFG: YAGEO; MFG P/N: RC0402FR-070RL; COMMON: 470-02332-00; ComponentLink1URL: https://www.digikey.com/en/products/detail/yageo/RC0402FR-070RL/2827570; Supplier 1: Digi-Key; Supplier Part Number 1: 311-0.0LRCT-ND; Value: 0; Package: 0402; Status: Released; DNI: DNI
U4 = TI_TPS62933PDRLR: IC REG BUCK ADJUSTABLE 3A SOT583; MFG: Texas Instruments; Supplier 1: Digi-Key; Supplier Part Number 1: 296-TPS62933PDRLRCT-ND; ComponentLink1URL: https://datasheet.ciiva.com/2034/tps54331-2034843.pdf?src-supplier=Digi-Key; MFG P/N: TPS62933PDRLR; Value: TPS62933PDRLR
U15 = CMP-0394-01493-2: IC REG LINEAR 3.3V 250MA 6WSON; MFG: Texas Instruments; ComponentLink1URL: http://www.ti.com/; MFG P/N: TPS72733DSET; Supplier 1: Digi-Key; Supplier Part Number 1: 296-27803-1-ND; Value: TPS72733DSET
U18 = TI_TPS54331GDR: Conv DC-DC Single Step Down 3.5V to 28V 8-Pin SOIC T/R; MFG: Texas Instruments; Supplier 1: Digi-Key; Supplier Part Number 1: 296-50099-1-ND; ComponentLink1URL: https://datasheet.ciiva.com/2034/tps54331-2034843.pdf?src-supplier=Digi-Key; MFG P/N: TPS54331GDR; Value: TPS54331GDR

## Sheet Temperature.SchDoc
size 420 x 297 mm; SheetNumber: 3; SheetTotal: 14; PageSetup: Record=PageOptions|CenterHorizontal=True|CenterVertical=True|PrintScale=0.96|XCorrection=1.00|YCorrection=1.00|PrintKind=1|BorderSize=5000000|LeftOffset=0|BottomOffset=0|Orientation=2|PaperLength=4318|PaperWidth=2794|Scale=100|PaperSource=7|PrintQuality=600|MediaType=1|DitherType=10|PaperKind=11" x 17"|PrintScaleMode=1
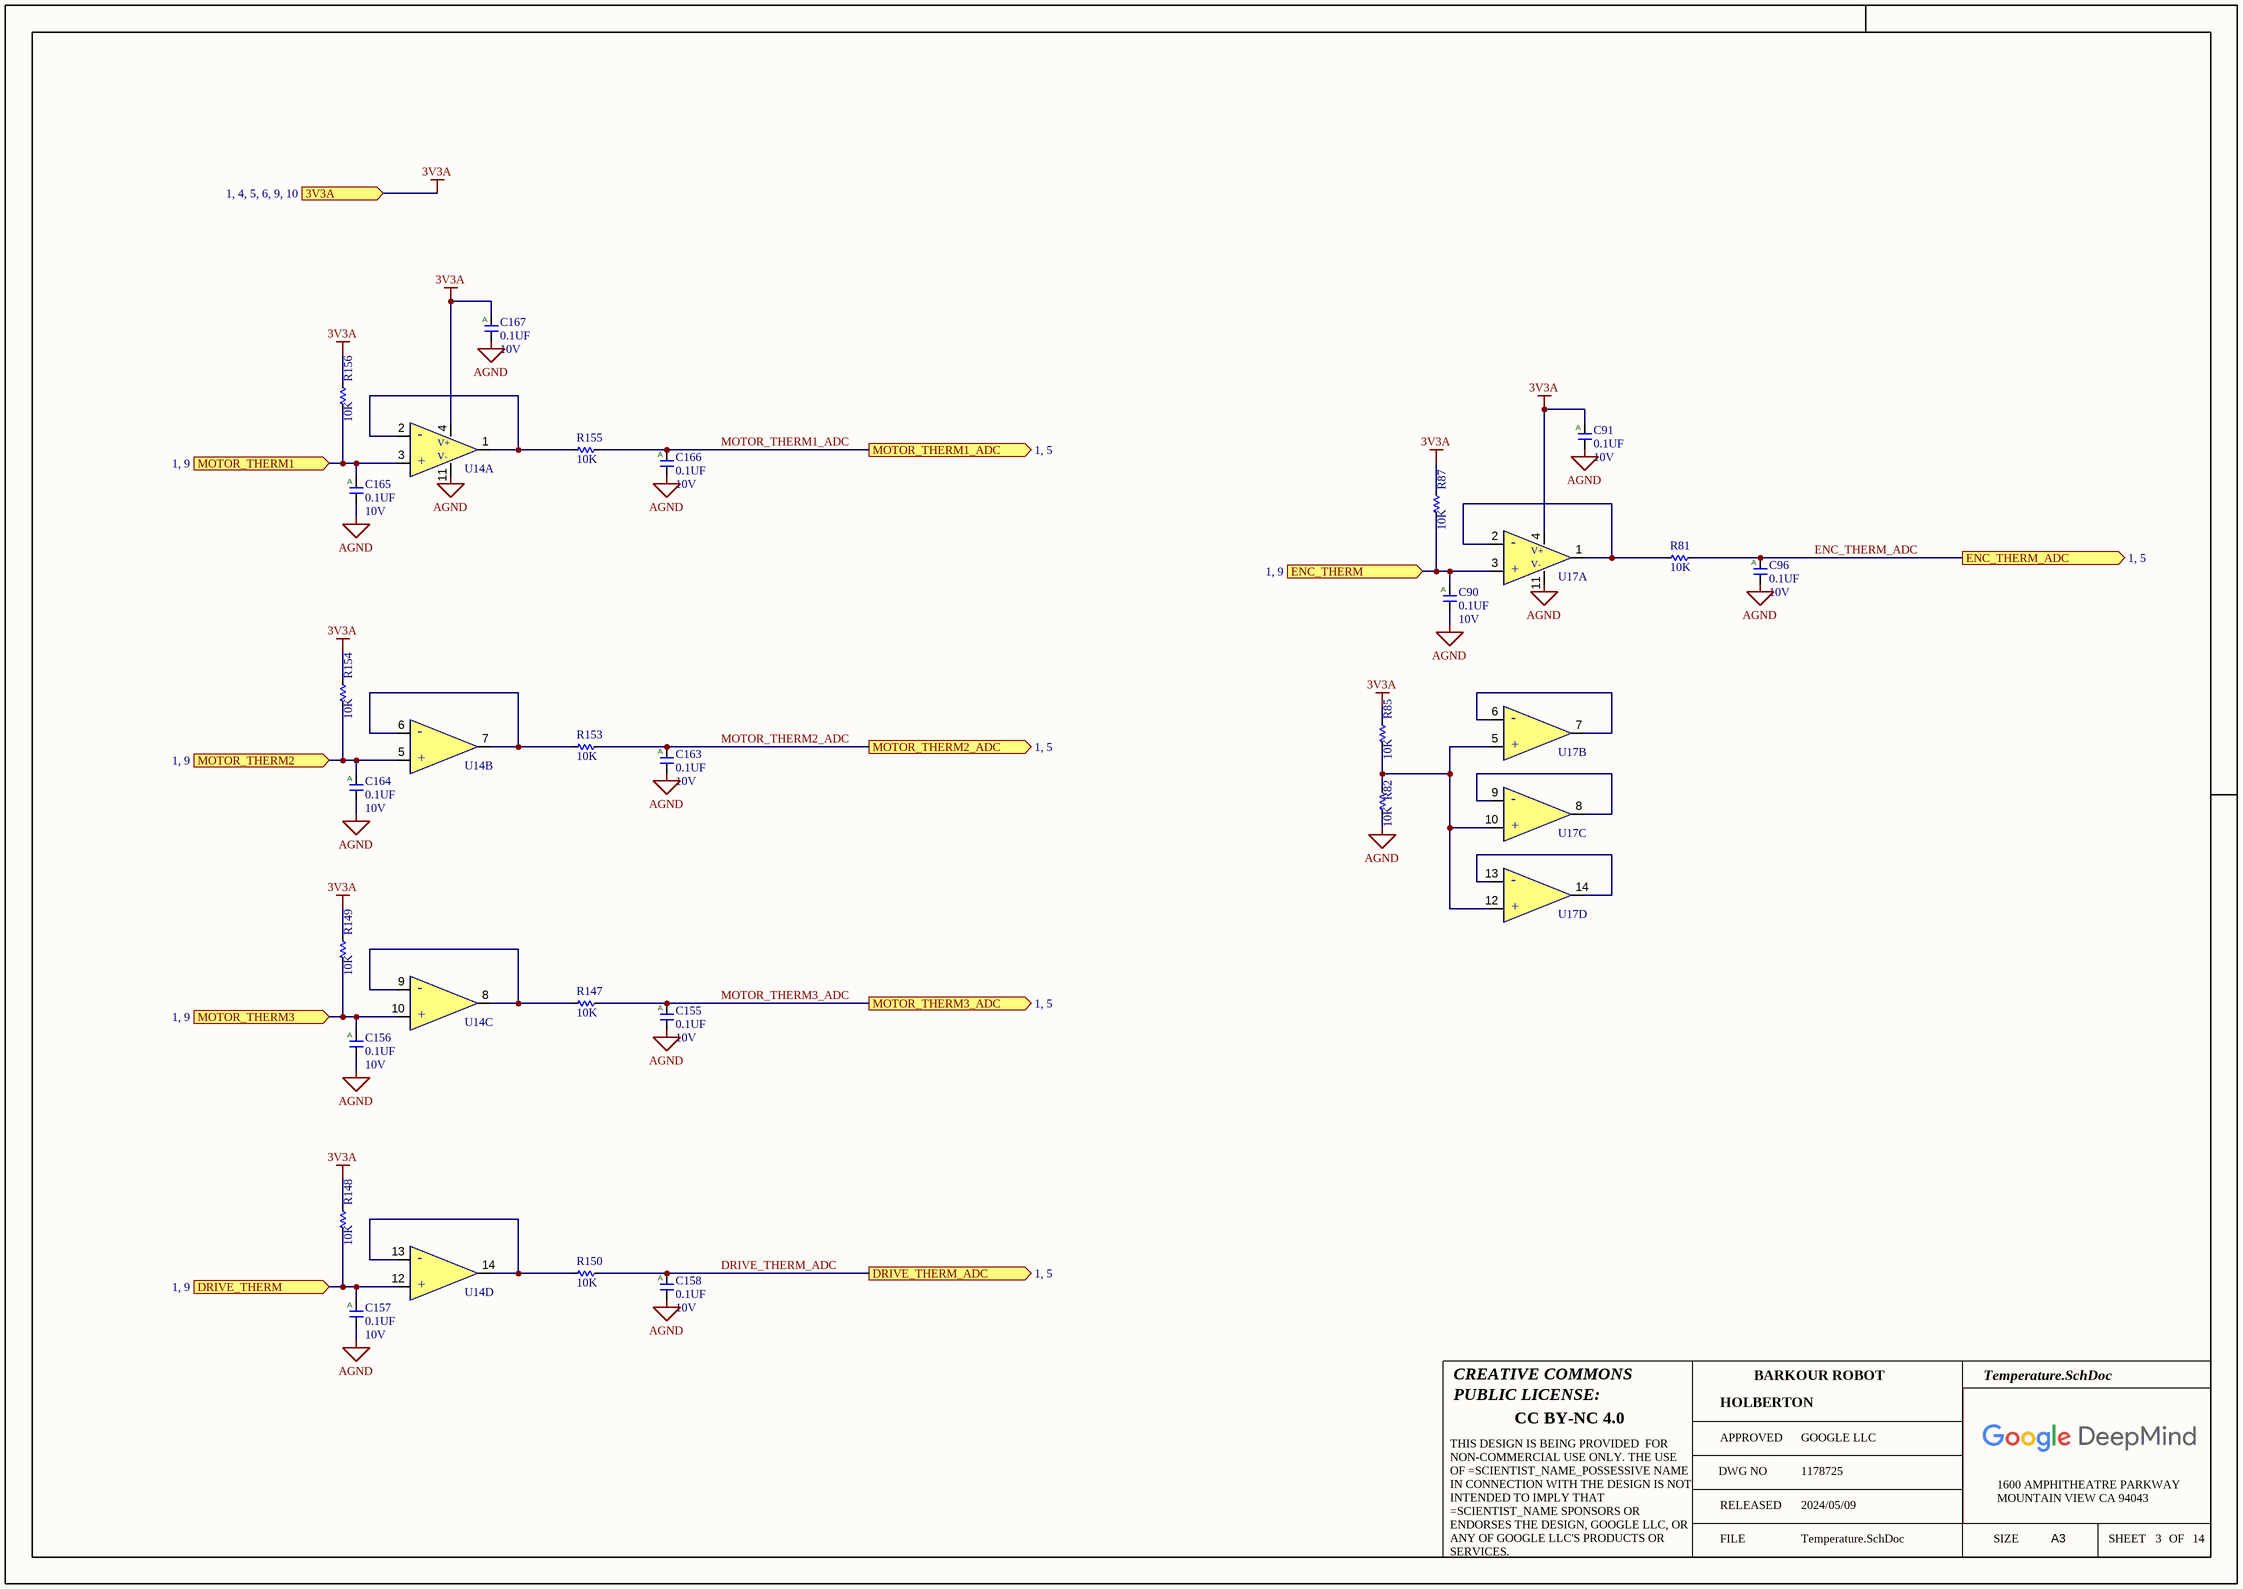
[diagram p6: Temperature.SchDoc]

### Parts
C90  value 0.1UF  Voltage: 10V  [C0201]  (hidden comment: __Template_Cap_Auto)
C91  value 0.1UF  Voltage: 10V  [C0201]  (hidden comment: __Template_Cap_Auto)
C96  value 0.1UF  Voltage: 10V  [C0201]  (hidden comment: __Template_Cap_Auto)
C155  value 0.1UF  Voltage: 10V  [C0201]  (hidden comment: __Template_Cap_Auto)
C156  value 0.1UF  Voltage: 10V  [C0201]  (hidden comment: __Template_Cap_Auto)
C157  value 0.1UF  Voltage: 10V  [C0201]  (hidden comment: __Template_Cap_Auto)
C158  value 0.1UF  Voltage: 10V  [C0201]  (hidden comment: __Template_Cap_Auto)
C163  value 0.1UF  Voltage: 10V  [C0201]  (hidden comment: __Template_Cap_Auto)
C164  value 0.1UF  Voltage: 10V  [C0201]  (hidden comment: __Template_Cap_Auto)
C165  value 0.1UF  Voltage: 10V  [C0201]  (hidden comment: __Template_Cap_Auto)
C166  value 0.1UF  Voltage: 10V  [C0201]  (hidden comment: __Template_Cap_Auto)
C167  value 0.1UF  Voltage: 10V  [C0201]  (hidden comment: __Template_Cap_Auto)
R81  value 10K  [R0201]  (hidden comment: __Template_Resistor)
R82  value 10K  [R0201]  (hidden comment: __Template_Resistor)
R85  value 10K  [R0201]  (hidden comment: __Template_Resistor)
R87  value 10K  [R0201]  (hidden comment: __Template_Resistor)
R147  value 10K  [R0201]  (hidden comment: __Template_Resistor)
R148  value 10K  [R0201]  (hidden comment: __Template_Resistor)
R149  value 10K  [R0201]  (hidden comment: __Template_Resistor)
R150  value 10K  [R0201]  (hidden comment: __Template_Resistor)
R153  value 10K  [R0201]  (hidden comment: __Template_Resistor)
R154  value 10K  [R0201]  (hidden comment: __Template_Resistor)
R155  value 10K  [R0201]  (hidden comment: __Template_Resistor)
R156  value 10K  [R0201]  (hidden comment: __Template_Resistor)
U14  MCP6064  [14TSSOP65]  (value not drawn)  (parts A,B,C,D of 4)
U17  MCP6064  [14TSSOP65]  (value not drawn)  (parts A,B,C,D of 4)

### Ports
3V3A (in, see 1, 4, 5, 6, 9, 10), DRIVE_THERM (in, see 1, 9), DRIVE_THERM_ADC (out, see 1, 5), ENC_THERM (in, see 1, 9), ENC_THERM_ADC (out, see 1, 5), MOTOR_THERM1 (in, see 1, 9), MOTOR_THERM1_ADC (out, see 1, 5), MOTOR_THERM2 (in, see 1, 9), MOTOR_THERM2_ADC (out, see 1, 5), MOTOR_THERM3 (in, see 1, 9), MOTOR_THERM3_ADC (out, see 1, 5)

### Nets
3V3A: C91.1 C167.1 R85.2 R87.2 R148.2 R149.2 R154.2 R156.2 U14.4 U17.4 ; port 3V3A
AGND: C90.2 C91.2 C96.2 C155.2 C156.2 C157.2 C158.2 C163.2 C164.2 C165.2 C166.2 C167.2 R82.1 U14.11 U17.11
DRIVE_THERM: C157.1 R148.1 U14.12 ; port DRIVE_THERM
DRIVE_THERM_ADC: C158.1 R150.2 ; port DRIVE_THERM_ADC
ENC_THERM_ADC: C96.1 R81.2 ; port ENC_THERM_ADC
MOTOR_THERM1: C165.1 R156.1 U14.3 ; port MOTOR_THERM1
MOTOR_THERM1_ADC: C166.1 R155.2 ; port MOTOR_THERM1_ADC
MOTOR_THERM2: C164.1 R154.1 U14.5 ; port MOTOR_THERM2
MOTOR_THERM2_ADC: C163.1 R153.2 ; port MOTOR_THERM2_ADC
MOTOR_THERM3: C156.1 R149.1 U14.10 ; port MOTOR_THERM3
MOTOR_THERM3_ADC: C155.1 R147.2 ; port MOTOR_THERM3_ADC
NetC90_1: C90.1 R87.1 U17.3 ; port ENC_THERM
NetR81_1: R81.1 U17.1 U17.2
NetR82_2: R82.2 R85.1 U17.5 U17.10 U17.12
NetR147_1: R147.1 U14.8 U14.9
NetR150_1: R150.1 U14.13 U14.14
NetR153_1: R153.1 U14.6 U14.7
NetR155_1: R155.1 U14.1 U14.2
NetU17_6: U17.6 U17.7
NetU17_8: U17.8 U17.9
NetU17_13: U17.13 U17.14

### Notes on the sheet
- CREATIVE COMMONS
- PUBLIC LICENSE:
- BARKOUR ROBOT
- CC BY-NC 4.0
- APPROVED
- DWG NO
- GOOGLE LLC
- FILE
- RELEASED
- 2024/05/09
- SIZE
- 1600 AMPHITHEATRE PARKWAY
- MOUNTAIN VIEW CA 94043
- A3
- SHEET
- OF
- THIS DESIGN IS BEING PROVIDED  FOR NON-COMMERCIAL USE ONLY. THE USE OF =SCIENTIST_NAME_POSSESSIVE NAME IN CONNECTION WITH THE DESIGN IS NOT INTENDED TO IMPLY THAT =SCIENTIST_NAME SPONSORS OR ENDORSES THE DESIGN, GOOGLE LLC, OR ANY OF GOOGLE LLC'S PRODUCTS OR SERVICES.
- (in symbol 934) A
- (in symbol MICROCHIP_MCP6064, part A) -; V+; V-; +
- (in symbol MICROCHIP_MCP6064, part B) -; +
- (in symbol MICROCHIP_MCP6064, part C) -; +
- (in symbol MICROCHIP_MCP6064, part D) -; +

### Library data of the parts
C90 C91 C96 C155-C158 C163-C167 = 934: CAP, CER, X6S, 0.1uF, 10V, 10%, 0201, AUTOGRADE; MFG: MURATA; MFG P/N: GRT033C81A104KE01D; COMMON: 150-01178-00; Status: Released; Package: 0201; Supplier 1: Digi-key; ComponentLink1URL: https://search.murata.co.jp/Ceramy/image/img/A01X/G101/ENG/GRT033C81A104KE01-01.pdf; Supplier Part Number 1: 490-12232-1-ND
R81 R82 R85 R87 R147-R150 R153-R156 = 6783: RES, 10K, 1%, 1/20W, 0201, AUTOGRADE; MFG: PANASONIC; MFG P/N: ERJ1GNF1002C; COMMON: 470-00033-00; Status: Released; Package: 0201; Supplier 1: Digi-Key; ComponentLink1URL: https://industrial.panasonic.com/cdbs/www-data/pdf/RDA0000/AOA0000C304.pdf; Supplier Part Number 1: P122414CT-ND
U14 U17 = MICROCHIP_MCP6064: Microchip MCP6064-E/ST; Quad Op Amp; 0.73MHz CMOS; Rail to Rail; 3V; 5V; 14-Pin TSSOP; MFG: Microchip Technology; ComponentLink1URL: http://www.microchip.com/mymicrochip/filehandler.aspx?ddocname=en528763; Supplier 1: Digi-Key; Supplier Part Number 1: MCP6064-E/ST-ND; MFG P/N: MCP6064-E/ST; Value: MCP6064

## Sheet MezzanineConnectors_Cortes.SchDoc
size 420 x 297 mm; SheetNumber: 9; SheetTotal: 14; PageSetup: Record=PageOptions|CenterHorizontal=True|CenterVertical=True|PrintScale=0.96|XCorrection=1.00|YCorrection=1.00|PrintKind=1|BorderSize=5000000|LeftOffset=0|BottomOffset=0|Orientation=2|PaperLength=4318|PaperWidth=2794|Scale=100|PaperSource=7|PrintQuality=600|MediaType=1|DitherType=10|PaperKind=11" x 17"|PrintScaleMode=1
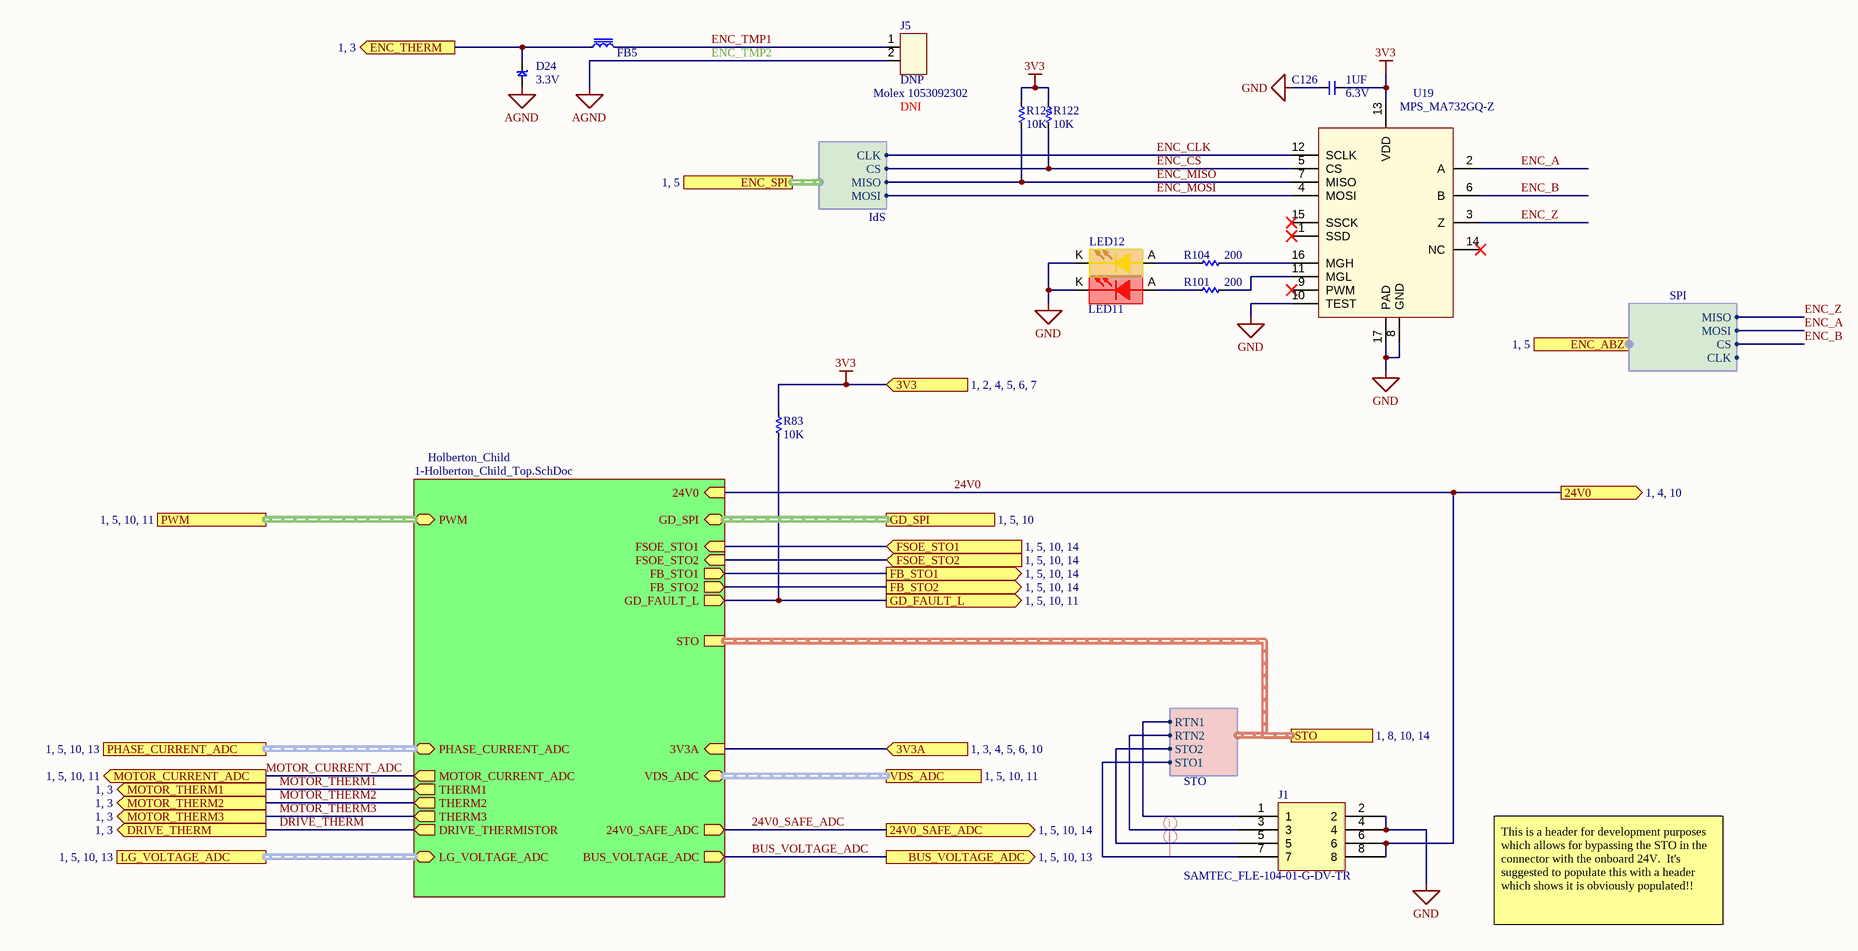
[diagram p7: MezzanineConnectors_Cortes.SchDoc]

### Parts
C126  value 1UF  Voltage: 6.3V  [C0201]  (hidden comment: __Template_Cap)
D24  3.3V  [SOD1060X40]
FB5  LAIRD MI0603L221R-10  [INDC160X80X105L30N]  (value not drawn)
J1  SAMTEC_FLE-104-01-G-DV-TR  [SAMTEC_FLE-104-01-G-DV-TR]
J5  DNP  value Molex 1053092302  [Molex 1053092302]
LED11  APHHS1005SURCK  [LED_APHHS1005SURCK]  (value not drawn)
LED12  SML-P11DTT86R  [LED_SML-P11DTT86R]  (value not drawn)
R83  value 10K  [R0201]  (hidden comment: __Template_Resistor)
R101  200  [R0201]
R104  200  [R0201]
R122  value 10K  [R0201]  (hidden comment: __Template_Resistor)
R123  value 10K  [R0201]  (hidden comment: __Template_Resistor)
U19  MPS_MA732GQ-Z  [MPS_MA732GQ-Z]

### Sub-sheets
Holberton_Child = 1-Holberton_Child_Top.SchDoc: PWM (bidir), GD_SPI (bidir), STO (harness STO), FSOE_STO1 (in), FSOE_STO2 (in), FB_STO1 (out), FB_STO2 (out), GD_FAULT_L (out), PHASE_CURRENT_ADC (bidir), MOTOR_CURRENT_ADC (out), THERM1 (out), THERM2 (out), THERM3 (out), DRIVE_THERMISTOR (out), LG_VOLTAGE_ADC (bidir), VDS_ADC (bidir), 24V0_SAFE_ADC (out), BUS_VOLTAGE_ADC (out), 3V3A (in), 24V0 (in)

### Ports
3V3 (in, see 1, 2, 4, 5, 6, 7), 3V3A (in, see 1, 3, 4, 5, 6, 10), 24V0 (out, see 1, 4, 10), 24V0_SAFE_ADC (out, see 1, 5, 10, 14), BUS_VOLTAGE_ADC (out, see 1, 5, 10, 13), DRIVE_THERM (out, see 1, 3), ENC_ABZ (harness SPI, see 1, 5), ENC_SPI (harness SPI, see 1, 5), ENC_THERM (out, see 1, 3), FB_STO1 (out, see 1, 5, 10, 14), FB_STO2 (out, see 1, 5, 10, 14), FSOE_STO1 (in, see 1, 5, 10, 14), FSOE_STO2 (in, see 1, 5, 10, 14), GD_FAULT_L (out, see 1, 5, 10, 11), GD_SPI (harness SPI, see 1, 5, 10), LG_VOLTAGE_ADC (harness Phases, see 1, 5, 10, 13), MOTOR_CURRENT_ADC (out, see 1, 5, 10, 11), MOTOR_THERM1 (out, see 1, 3), MOTOR_THERM2 (out, see 1, 3), MOTOR_THERM3 (out, see 1, 3), PHASE_CURRENT_ADC (harness Phases, see 1, 5, 10, 13), PWM (harness PWM, see 1, 5, 10, 11), STO (harness STO, see 1, 8, 10, 14), VDS_ADC (harness Phases, see 1, 5, 10, 11)

### Harnesses
SPI: CLK, CS, MOSI, MISO
STO: RTN1, RTN2, STO1, STO2

### Nets
3V3: C126.2 R83.2 R122.2 R123.2 U19.13(VDD) ; port 3V3
3V3A: port 3V3A, sheet Holberton_Child/3V3A
AGND: D24.A J5.2
GND: C126.1 J1.2 J1.4 LED11.K LED12.K U19.8(GND) U19.10(TEST) U19.17(PAD)
24V0: J1.6 J1.8 ; port 24V0, sheet Holberton_Child/24V0
24V0_SAFE_ADC: port 24V0_SAFE_ADC, sheet Holberton_Child/24V0_SAFE_ADC
BUS_VOLTAGE_ADC: port BUS_VOLTAGE_ADC, sheet Holberton_Child/BUS_VOLTAGE_ADC
DRIVE_THERM: port DRIVE_THERM, sheet Holberton_Child/DRIVE_THERMISTOR
ENC_A: U19.2(A) ; port ENC_ABZ.MOSI
ENC_B: U19.6(B) ; port ENC_ABZ.CS
ENC_CLK: U19.12(SCLK) ; port ENC_SPI.CLK
ENC_CS: R122.1 U19.5(CS) ; port ENC_SPI.CS
ENC_MISO: R123.1 U19.7(MISO) ; port ENC_SPI.MISO
ENC_MOSI: U19.4(MOSI) ; port ENC_SPI.MOSI
ENC_TMP1: FB5.2 J5.1
ENC_Z: U19.3(Z) ; port ENC_ABZ.MISO
FB_STO1: port FB_STO1, sheet Holberton_Child/FB_STO1
FB_STO2: port FB_STO2, sheet Holberton_Child/FB_STO2
FSOE_STO1: port FSOE_STO1, sheet Holberton_Child/FSOE_STO1
FSOE_STO2: port FSOE_STO2, sheet Holberton_Child/FSOE_STO2
GD_FAULT_L: R83.1 ; port GD_FAULT_L, sheet Holberton_Child/GD_FAULT_L
MOTOR_CURRENT_ADC: port MOTOR_CURRENT_ADC, sheet Holberton_Child/MOTOR_CURRENT_ADC
MOTOR_THERM1: port MOTOR_THERM1, sheet Holberton_Child/THERM1
MOTOR_THERM2: port MOTOR_THERM2, sheet Holberton_Child/THERM2
MOTOR_THERM3: port MOTOR_THERM3, sheet Holberton_Child/THERM3
STO1: J1.7 ; port STO.STO1
STO2: J1.5 ; port STO.STO2
STO_RET1: J1.1 ; port STO.RTN1
STO_RET2: J1.3 ; port STO.RTN2
NetC90_1: D24.K FB5.1 ; port ENC_THERM
NetLED11_A: LED11.A R101.2
NetLED12_A: LED12.A R104.2
NetR101_1: R101.1 U19.11(MGL)
NetR104_1: R104.1 U19.16(MGH)

Not connected (* = marked no-connect by the designer): U19 1(SSD)* 9(PWM)* 14(NC)* 15(SSCK)*

### Buses and harness runs
harness port GD_SPI = sheet Holberton_Child/GD_SPI
harness port LG_VOLTAGE_ADC = sheet Holberton_Child/LG_VOLTAGE_ADC
harness port PHASE_CURRENT_ADC = sheet Holberton_Child/PHASE_CURRENT_ADC
harness port PWM = sheet Holberton_Child/PWM
harness port STO = sheet Holberton_Child/STO
harness port VDS_ADC = sheet Holberton_Child/VDS_ADC

### Layout directives
net class 24V: STO1, STO2

### Notes on the sheet
- ENC_TMP2
- This is a header for development purposes which allows for bypassing the STO in the connector with the onboard 24V.  It's suggested to populate this with a header which shows it is obviously populated!!
- CREATIVE COMMONS
- PUBLIC LICENSE:
- BARKOUR ROBOT
- CC BY-NC 4.0
- APPROVED
- DWG NO
- GOOGLE LLC
- FILE
- RELEASED
- 2024/05/09
- SIZE
- 1600 AMPHITHEATRE PARKWAY
- MOUNTAIN VIEW CA 94043
- A3
- SHEET
- OF
- THIS DESIGN IS BEING PROVIDED  FOR NON-COMMERCIAL USE ONLY. THE USE OF =SCIENTIST_NAME_POSSESSIVE NAME IN CONNECTION WITH THE DESIGN IS NOT INTENDED TO IMPLY THAT =SCIENTIST_NAME SPONSORS OR ENDORSES THE DESIGN, GOOGLE LLC, OR ANY OF GOOGLE LLC'S PRODUCTS OR SERVICES.

### Library data of the parts
C126 = 240: CAP, CER, X5R, 1uF, 6.3V, 20%, 0201, 0.33mm T; MFG: SAMSUNG; MFG P/N: CL03A105MQ3CSNC; COMMON: 150-00980-00; Status: Released; Package: 0201; Supplier 1: Digi-Key; ComponentLink1URL: https://www.digikey.com/en/products/detail/samsung-electro-mechanics/CL03A105MQ3CSNC/3886983; Supplier Part Number 1: 1276-1325-1-ND
D24 = 192: TVS, DIODE, UNIDIR, 3.3VRWM, 4.8VBR, 7.8VCL, SOD-923; MFG: ON Semiconductor; MFG P/N: ESD9R3.3ST5G; Value: ESD9R3.3ST5G; Status: Released; Package: SOD-923; Supplier 1: Digi-Key; ComponentLink1URL: http://www.onsemi.com/pub/Collateral/ESD9R3.3S-D.PDF; Supplier Part Number 1: ESD9R3.3ST5GOSCT-ND
FB5 = LAIRD_MI0603L221R-10: FERRITE BEAD 220 OHM 0603 1LN; Value: 220 Ohms @ 100 MHz; MFG: Laird-Signal Integrity Products; Package: Inductor, 0603; ComponentLink1URL: https://media.digikey.com/pdf/Data%20Sheets/Laird%20Technologies/EMI_Filtering_and_RF_Inductors.pdf; Status: Preliminary; Supplier 1: Digi-Key; Supplier Part Number 1: 240-2558-1-ND; MFG P/N: MI0603L221R-10
J1 = SAMTEC_FLE-104-01-G-DV-TR: CONN RCPT .05" 8POS DUAL SMD; MFG: Samtec Inc.; Supplier 1: Digi-Key; Supplier Part Number 1: SAM1226-04-ND; ComponentLink1URL: https://datasheet.ciiva.com/747/fle-1xx-xx-xx-dv-x-mkt1-747009.pdf?src-supplier=Digi-Key; MFG P/N: FLE-104-01-G-DV; Value: FLE-104-01-G-DV
J5 = Molex 1053092302: CONN HEADER VERT 2POS 2.5MM; MFG: Molex; ComponentLink1URL: https://www.digikey.com/en/products/detail/molex/1053092302/6164139; MFG P/N: 1053092302; Supplier 1: Digi-Key; Supplier Part Number 1: WM15050-ND; DNI: DNI
LED11 = APHHS1005SURCK: LED RED CLEAR CHIP SMD; MFG: Kingbright; Status: Released; MFG P/N: APHHS1005SURCK; Package: 0402; Value: APHHS1005SURCK; Supplier 1: Digi-Key; ComponentLink1URL: http://www.kingbrightusa.com/images/catalog/SPEC/APG0603SYC-TT.pdf; Supplier Part Number 1: 754-1104-1-ND
LED12 = SML-P11DTT86R: LED ORANGE CLEAR 1006 SMD; MFG: Rohm Semiconductor; Status: Released; MFG P/N: SML-P11DTT86R; Package: 0402; Value: SML-P11DTT86R; Supplier 1: Digi-Key; ComponentLink1URL: http://www.kingbrightusa.com/images/catalog/SPEC/APG0603SYC-TT.pdf; Supplier Part Number 1: SML-P11DTT86RCT-ND
R83 R122 R123 = 6783: as R81 on sheet Temperature; Status: Released; Package: 0201; Supplier 1: Digi-Key; ComponentLink1URL: https://industrial.panasonic.com/cdbs/www-data/pdf/RDA0000/AOA0000C304.pdf; Supplier Part Number 1: P122414CT-ND
R101 R104 = 10010: RES, 200, 1%, 1/20W, 0201, AUTOGRADE; MFG: Panasonic Electronic Components; MFG P/N: ERJ-1GNF2000C; Status: Released; Package: 0201; Value: 200; Supplier 1: Digi-Key; ComponentLink1URL: https://www.bourns.com/docs/product-datasheets/crxxxxa.pdf; Supplier Part Number 1: P122416CT-ND
U19 = MPS_MA732GQ-Z: 14-BIT, DIGITAL, CONTACTLESS ANG; MFG: Monolithic Power Systems Inc.; ComponentLink1URL: https://www.digikey.com/en/products/detail/monolithic-power-systems-inc/MA732GQ-Z/15196210; MFG P/N: MA732GQ-Z; Supplier 1: Digi-Key; Supplier Part Number 1: 1589-MA732GQ-ZCT-ND; Value: MA732GQ-Z

## Sheet 1-Holberton_Child_Top.SchDoc
size 420 x 297 mm; DocumentNumber: 1; SheetNumber: 10; SheetTotal: 14; PageSetup: Record=PageOptions|CenterHorizontal=True|CenterVertical=True|PrintScale=0.96|XCorrection=1.00|YCorrection=1.00|PrintKind=1|BorderSize=5000000|LeftOffset=0|BottomOffset=0|Orientation=2|PaperLength=4318|PaperWidth=2794|Scale=100|PaperSource=7|PrintQuality=600|MediaType=1|DitherType=10|PaperKind=11" x 17"|PrintScaleMode=1
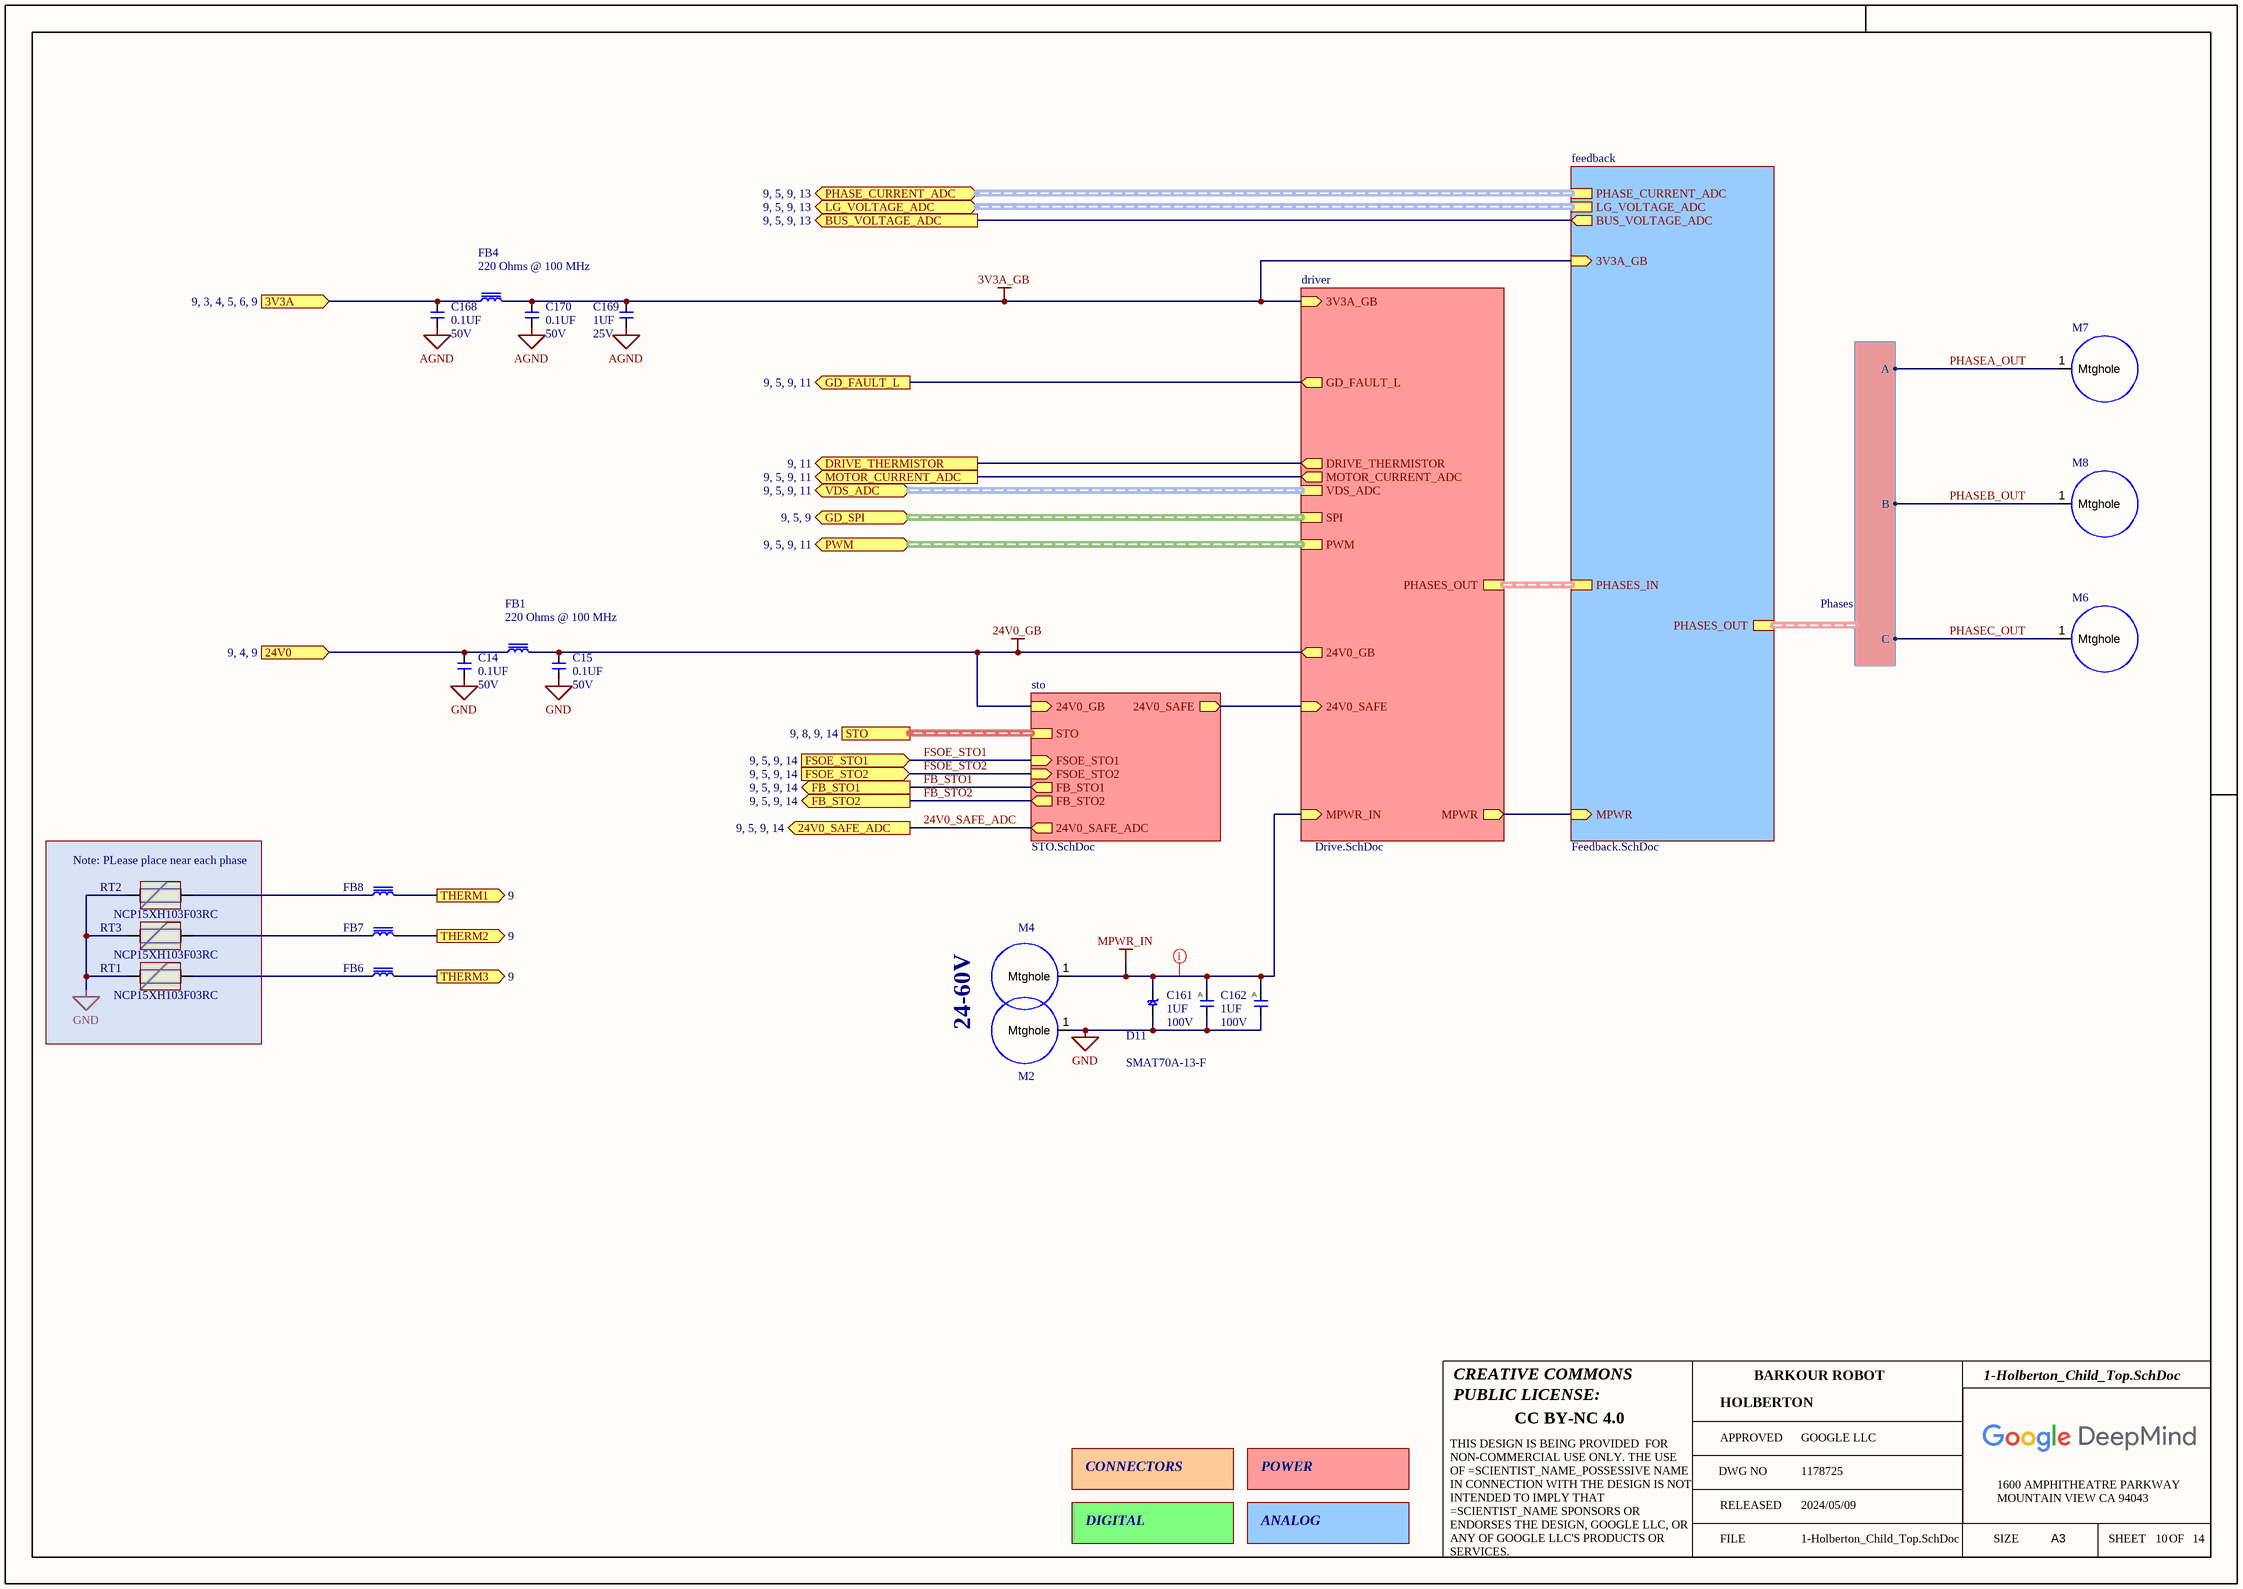
[diagram p8: 1-Holberton_Child_Top.SchDoc]

### Parts
C14  value 0.1UF  Voltage: 50V  [C0402]  (hidden comment: __Template_Cap)
C15  value 0.1UF  Voltage: 50V  [C0402]  (hidden comment: __Template_Cap)
C161  value 1UF  Voltage: 100V  [C0805]  (hidden comment: __Template_Cap_Auto)
C162  value 1UF  Voltage: 100V  [C0805]  (hidden comment: __Template_Cap_Auto)
C168  value 0.1UF  Voltage: 50V  [C0402]  (hidden comment: __Template_Cap)
C169  value 1UF  Voltage: 25V  [C0402]  (hidden comment: __Template_Cap)
C170  value 0.1UF  Voltage: 50V  [C0402]  (hidden comment: __Template_Cap)
D11  value SMAT70A-13-F  [SMA_B130-13-F]  (hidden comment: __Template_Diode_TVS_A/K)
FB1  value 220 Ohms @ 100 MHz  [INDC160X80X105L30N]  (hidden comment: LAIRD MI0603L221R-10)
FB4  value 220 Ohms @ 100 MHz  [INDC160X80X105L30N]  (hidden comment: LAIRD MI0603L221R-10)
FB6  LAIRD MI0603L221R-10  [INDC160X80X105L30N]  (value not drawn)
FB7  LAIRD MI0603L221R-10  [INDC160X80X105L30N]  (value not drawn)
FB8  LAIRD MI0603L221R-10  [INDC160X80X105L30N]  (value not drawn)
M2  1.7mm hole 5mm pad  [1.7hole5padRD]  (value not drawn)  (no BOM)
M4  1.7mm hole 5mm pad  [1.7hole5padRD]  (value not drawn)  (no BOM)
M6  Keystone_8737  [Keystone_8737]  (value not drawn)
M7  Keystone_8737  [Keystone_8737]  (value not drawn)
M8  Keystone_8737  [Keystone_8737]  (value not drawn)
RT1  Mfg P/N: NCP15XH103F03RC  [R0402]  (hidden comment: __Template_Thermistor)
RT2  Mfg P/N: NCP15XH103F03RC  [R0402]  (hidden comment: __Template_Thermistor)
RT3  Mfg P/N: NCP15XH103F03RC  [R0402]  (hidden comment: __Template_Thermistor)

### Blocks framed on the sheet
Note: PLease place near each phase: RT1-RT3

### Sub-sheets
driver = Drive.SchDoc: PWM (harness PWM), SPI (harness SPI), 24V0_GB (out), 24V0_SAFE (in), MPWR_IN (in), MOTOR_CURRENT_ADC (out), VDS_ADC (harness Phases), PHASES_OUT (harness Phases), 3V3A_GB (in), GD_FAULT_L (out), DRIVE_THERMISTOR (out), MPWR (out)
feedback = Feedback.SchDoc: PHASE_CURRENT_ADC (harness Phases), PHASES_OUT (harness Phases), PHASES_IN (harness Phases), LG_VOLTAGE_ADC (harness Phases), BUS_VOLTAGE_ADC (out), 3V3A_GB (in), MPWR (in)
sto = STO.SchDoc: FB_STO2 (out), FSOE_STO1 (in), FSOE_STO2 (in), FB_STO1 (out), 24V0_SAFE (out), 24V0_SAFE_ADC (out), 24V0_GB (in), STO (harness STO)

### Ports
3V3A (in, see 9, 3, 4, 5, 6, 9), 24V0 (in, see 9, 4, 9), 24V0_SAFE_ADC (out, see 9, 5, 9, 14), BUS_VOLTAGE_ADC (out, see 9, 5, 9, 13), DRIVE_THERMISTOR (out, see 9, 11), FB_STO1 (out, see 9, 5, 9, 14), FB_STO2 (out, see 9, 5, 9, 14), FSOE_STO1 (in, see 9, 5, 9, 14), FSOE_STO2 (in, see 9, 5, 9, 14), GD_FAULT_L (out, see 9, 5, 9, 11), GD_SPI (bidir, see 9, 5, 9), LG_VOLTAGE_ADC (bidir, see 9, 5, 9, 13), MOTOR_CURRENT_ADC (out, see 9, 5, 9, 11), PHASE_CURRENT_ADC (bidir, see 9, 5, 9, 13), PWM (bidir, see 9, 5, 9, 11), STO (harness STO, see 9, 8, 9, 14), THERM1 (out, see 9), THERM2 (out, see 9), THERM3 (out, see 9), VDS_ADC (bidir, see 9, 5, 9, 11)

### Harnesses
Phases: A, B, C

### Nets
3V3A: C168.1 FB4.1 ; port 3V3A
3V3A_GB: C169.1 C170.1 FB4.2 ; sheet feedback/3V3A_GB, sheet driver/3V3A_GB
24V0_GB: C15.1 FB1.2 ; sheet driver/24V0_GB, sheet sto/24V0_GB
AGND: C168.2 C169.2 C170.2
GND: C14.2 C15.2 C161.2 C162.2 D11.A M2.1(Mtghole) RT1.2 RT2.2 RT3.2
MPWR: sheet feedback/MPWR, sheet driver/MPWR
MPWR_IN: C161.1 C162.1 D11.K M4.1(Mtghole) ; sheet driver/MPWR_IN
24V0: C14.1 FB1.1 ; port 24V0
24V0_SAFE: sheet driver/24V0_SAFE, sheet sto/24V0_SAFE
24V0_SAFE_ADC: port 24V0_SAFE_ADC, sheet sto/24V0_SAFE_ADC
BUS_VOLTAGE_ADC: port BUS_VOLTAGE_ADC, sheet feedback/BUS_VOLTAGE_ADC
DRIVE_THERM: port DRIVE_THERMISTOR, sheet driver/DRIVE_THERMISTOR
FB_STO1: port FB_STO1, sheet sto/FB_STO1
FB_STO2: port FB_STO2, sheet sto/FB_STO2
FSOE_STO1: port FSOE_STO1, sheet sto/FSOE_STO1
FSOE_STO2: port FSOE_STO2, sheet sto/FSOE_STO2
GD_FAULT_L: port GD_FAULT_L, sheet driver/GD_FAULT_L
MOTOR_CURRENT_ADC: port MOTOR_CURRENT_ADC, sheet driver/MOTOR_CURRENT_ADC
MOTOR_THERM1: FB8.2 ; port THERM1
MOTOR_THERM2: FB7.2 ; port THERM2
MOTOR_THERM3: FB6.2 ; port THERM3
PHASEA_OUT: M7.1(Mtghole) ; sheet feedback/PHASES_OUT.A
PHASEB_OUT: M8.1(Mtghole) ; sheet feedback/PHASES_OUT.B
PHASEC_OUT: M6.1(Mtghole) ; sheet feedback/PHASES_OUT.C
NetFB6_1: FB6.1 RT1.1
NetFB7_1: FB7.1 RT3.1
NetFB8_1: FB8.1 RT2.1

### Buses and harness runs
harness port GD_SPI = sheet driver/SPI
harness port LG_VOLTAGE_ADC = sheet feedback/LG_VOLTAGE_ADC
harness port PHASE_CURRENT_ADC = sheet feedback/PHASE_CURRENT_ADC
harness port PWM = sheet driver/PWM
harness port STO = sheet sto/STO
harness port VDS_ADC = sheet driver/VDS_ADC
harness sheet driver/PHASES_OUT = sheet feedback/PHASES_IN

### Layout directives
net class HV: MPWR_IN

### Notes on the sheet
- 24-60V
- CONNECTORS
- POWER
- DIGITAL
- ANALOG
- CREATIVE COMMONS
- PUBLIC LICENSE:
- BARKOUR ROBOT
- CC BY-NC 4.0
- APPROVED
- DWG NO
- GOOGLE LLC
- FILE
- RELEASED
- 2024/05/09
- SIZE
- 1600 AMPHITHEATRE PARKWAY
- MOUNTAIN VIEW CA 94043
- A3
- SHEET
- OF
- THIS DESIGN IS BEING PROVIDED  FOR NON-COMMERCIAL USE ONLY. THE USE OF =SCIENTIST_NAME_POSSESSIVE NAME IN CONNECTION WITH THE DESIGN IS NOT INTENDED TO IMPLY THAT =SCIENTIST_NAME SPONSORS OR ENDORSES THE DESIGN, GOOGLE LLC, OR ANY OF GOOGLE LLC'S PRODUCTS OR SERVICES.
- (in symbol 1093) A

### Library data of the parts
C14 C15 C168 C170 = 1762: CAP, CER, X5R, 0.1uF, 10%, 50V, 0402, 0.55mm; MFG: YAGEO; MFG P/N: CC0402KRX5R9BB104; Status: Released; Package: 0402; Supplier 1: Digi-Key; ComponentLink1URL: http://www.yageo.com/documents/recent/UPY-GPHC_X5R_4V-to-50V_25.pdf; Supplier Part Number 1: 311-3342-1-ND
C161 C162 = 1093: CAP, CER, X7S, 1uF, 20%, 100V, 0805; MFG: TDK; MFG P/N: CGA4J3X7S2A105M125AE; COMMON: 150-01093-00; Status: Released; Package: 0805; Supplier 1: Digi-Key; ComponentLink1URL: https://www.digikey.com/en/products/detail/tdk-corporation/CGA4J3X7S2A105M125AE/2782484; Supplier Part Number 1: 445-7961-1-ND
C169 = 1717: CAP, CER, X5R, 1uF, 10%, 25V, 0402; MFG: TDK; MFG P/N: C1005X5R1E105K050BC; COMMON: 150-01202-00; Status: Released; Package: 0402; Supplier 1: Digi-Key; ComponentLink1URL: https://product.tdk.com/info/en/catalog/datasheets/mlcc_commercial_general_en.pdf; Supplier Part Number 1: 445-9066-1-ND
D11 = 200: DIODE, TVS, UNI-DIR, 70VR, 100VCL, 400W, 140PF @1MHZ, SMA; MFG: Diodes Incorporated; Status: Released; MFG P/N: SMAT70A-13-F; Package: SMA; Supplier 1: Digi-Key; ComponentLink1URL: https://www.diodes.com/assets/Datasheets/ds30213.pdf; Supplier Part Number 1: SMAT70A-FDICT-ND
FB1 FB4 = f5bd4cf1-070f-4480-bf1a-f8cba0e78574: FERRITE BEAD 220 OHM 0603 1LN; MFG: Laird-Signal Integrity Products; Package: Inductor, 0603; ComponentLink1URL: https://media.digikey.com/pdf/Data%20Sheets/Laird%20Technologies/EMI_Filtering_and_RF_Inductors.pdf; Status: Preliminary; MFG P/N: MI0603L221R-10; Supplier 1: Digi-Key; Supplier Part Number 1: 240-2558-1-ND
FB6-FB8 = f5bd4cf1-070f-4480-bf1a-f8cba0e78574: FERRITE BEAD 220 OHM 0603 1LN; Value: 220 Ohms @ 100 MHz; MFG: Laird-Signal Integrity Products; Package: Inductor, 0603; ComponentLink1URL: https://media.digikey.com/pdf/Data%20Sheets/Laird%20Technologies/EMI_Filtering_and_RF_Inductors.pdf; Status: Preliminary; MFG P/N: MI0603L221R-10; Supplier 1: Digi-Key; Supplier Part Number 1: 240-2558-1-ND
M2 M4 = MtgHole_1
M6-M8 = MtgHole_1: Motor lead attachement points Keystone_8737; MFG: Keystone Electronics; MFG P/N: 8737; Value: 8737; Supplier 1: Digi-Key; Supplier Part Number 1: 36-8737-ND
RT1-RT3 = 175: SENSOR, THERMISTOR, NTC, 10K, 1%, 3380K, 100mW, 0402; Mfg: Murata Electronics; Value: 10KOHM; Status: Released; Package: 0402; Supplier 1: Digi-Key; ComponentLink1URL: https://www.murata.com/en-us/api/pdfdownloadapi?cate=&partno=NCP15XH103F03RC; Supplier Part Number 1: 490-4801-1-ND